# EAGLE design cyclops_r3 (EAGLE 6.5.0)
DESIGNER: JONATHAN P. NEWMAN; DOC_NUMBER: N/A; REVISION: 3.5C

## Sheet 1 of 5: I/O Interface
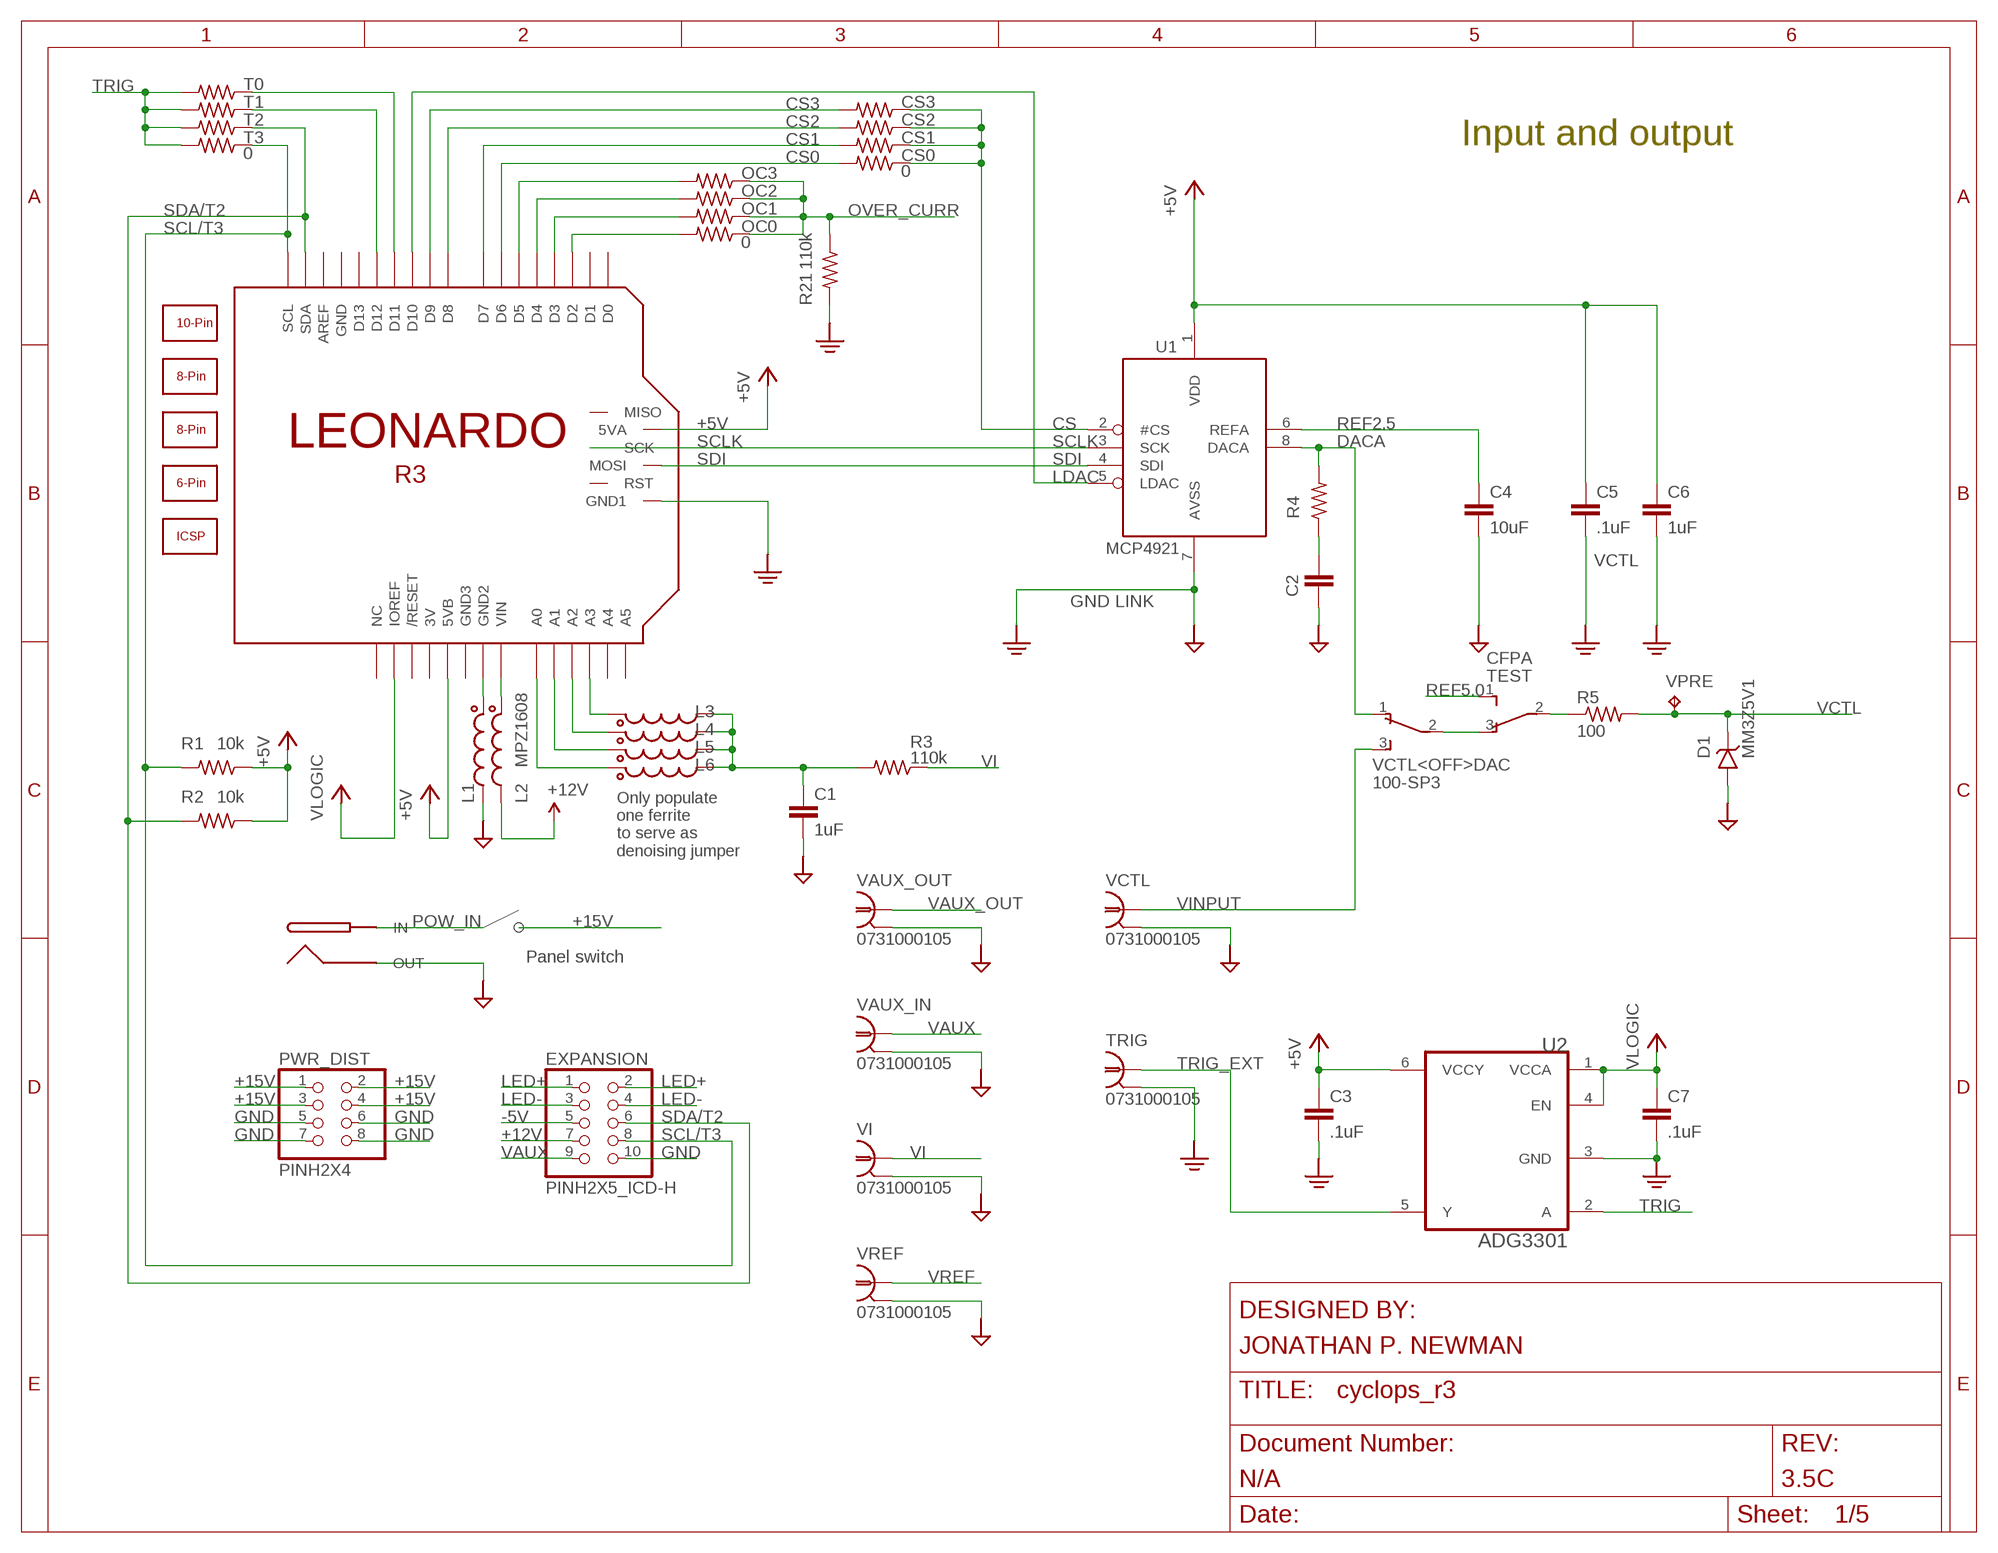
[diagram p0: schematic, sheet 1]

### Parts
C1  1uF  C_0805  [0805]
C2  C_0603  [0603]
C3  .1uF  C_0603  [0603]
C4  10uF  C_1206  [1206]
C5  .1uF  C_0603  [0603]
C6  1uF  C_0805  [0805]
C7  .1uF  C_0603  [0603]
CS0  0  R_0603  [0603]
CS1  0  R_0603  [0603]
CS2  0  R_0603  [0603]
CS3  0  R_0603  [0603]
D1  MM3Z5V1  Z-DIODE_SOD-323  [SOD-323]
EXPANSION  PINH2X5_ICD-H  [2X05-IDC]
L1  MPZ1608  L_0603  [0603]
L2  MPZ1608  L_0603  [0603]
L3  MPZ1608  L_0603  [0603]
L4  MPZ1608  L_0603  [0603]
L5  MPZ1608  L_0603  [0603]
L6  MPZ1608  L_0603  [0603]
LEONARDO  LEONARDO_R3_ICSP  [ARDUINOR3_PINS_NOHOLES]
OC0  0  R_0603  [0603]
OC1  0  R_0603  [0603]
OC2  0  R_0603  [0603]
OC3  0  R_0603  [0603]
POWER  PJ-063BH  BARREL-JACK_PJ-063BH  [PJ-063BH]
PWR_DIST  PINH2X4  [2X04-BIG]
R1  10k  R_0603  [0603]
R2  10k  R_0603  [0603]
R3  110k  R_0603  [0603]
R4  R_0603  [0603]
R5  100  R_0603  [0603]
R21  110k  R_0603  [0603]
T0  0  R_0603  [0603]
T1  0  R_0603  [0603]
T2  0  R_0603  [0603]
T3  0  R_0603  [0603]
TEST  CFPA  SPDT_CFPA  [CFPA]
TRIG  0731000105  BNC_0731000105  [0731000105]
U1  MCP4921  MCP4921SOIC  [SO08]
U2  ADG3301  ADG3301BKSZ-REEL  [SOT65P210X110-6N]
VAUX_IN  0731000105  BNC_0731000105  [0731000105]
VAUX_OUT  0731000105  BNC_0731000105  [0731000105]
VCTL  0731000105  BNC_0731000105  [0731000105]
VCTL<OFF>DAC  100-SP3  SPDT_2M-WITHOFF  [2M1-SP1-T2-B4-M6RE]
VI  0731000105  BNC_0731000105  [0731000105]
VPRE  TPTP16R  [TP16R]
VREF  0731000105  BNC_0731000105  [0731000105]

### Nets
+5V: C3.1 C5.1 C6.1 LEONARDO.5VA LEONARDO.5VB R1.1 R2.1 U1.1(VDD) U2.6(VCCY)
+12V [pwr]: EXPANSION.7 L2.2 ; also sheet 2,3,4,5
+15V [pwr]: PWR_DIST.1 PWR_DIST.2 PWR_DIST.3 PWR_DIST.4 ; also sheet 2
-5V: EXPANSION.5 ; also sheet 2
CS: CS0.1 CS1.1 CS2.1 CS3.1 U1.2(#CS)
CS0: CS0.2 LEONARDO.D6
CS1: CS1.2 LEONARDO.D7
CS2: CS2.2 LEONARDO.D8
CS3: CS3.2 LEONARDO.D9
DACA: R4.2 U1.8(DACA) VCTL<OFF>DAC.1
GND: C1.2 C2.2 C3.2 C4.2 C5.2 C6.2 C7.2 D1.A EXPANSION.10 L1.2 LEONARDO.GND1 POWER.2(OUT) PWR_DIST.5 PWR_DIST.6 PWR_DIST.7 PWR_DIST.8 R21.2 TRIG.2 TRIG.3 U1.7(AVSS) U2.3(GND) VAUX_IN.2 VAUX_IN.3 VAUX_OUT.2 VAUX_OUT.3 VCTL.2 VCTL.3 VI.2 VI.3 VREF.2 VREF.3 ; also sheet 2,3,4,5
KEEPOUT_GND: L1.1 LEONARDO.GND2
LDAC: LEONARDO.D10 U1.5(LDAC)
LED+: EXPANSION.1 EXPANSION.2 ; also sheet 5
LED-: EXPANSION.3 EXPANSION.4 ; also sheet 5
N$1: C2.1 R4.1
N$7: L6.1 LEONARDO.A0
N$11: C1.1 L3.2 L4.2 L5.2 L6.2 R3.2
N$14: R5.1 TEST.2
N$19: L5.1 LEONARDO.A1
N$21: L4.1 LEONARDO.A2
N$23: L3.1 LEONARDO.A3
N$34: TEST.3 VCTL<OFF>DAC.2
N$40: LEONARDO.D2 OC0.2
OC0: LEONARDO.D3 OC1.2
OC1: LEONARDO.D4 OC2.2
OC2: LEONARDO.D5 OC3.2
OVER_CURR: OC0.1 OC1.1 OC2.1 OC3.1 R21.1 ; also sheet 3,5
POW_IN [pwr]: POWER.1(IN)
REF2.5: C4.1 U1.6(REFA) ; also sheet 4
REF5.0: TEST.1 ; also sheet 4
SCL/T3: EXPANSION.8 LEONARDO.SCL R1.2 T3.1
SCLK: LEONARDO.SCK U1.3(SCK)
SDA/T2: EXPANSION.6 LEONARDO.SDA R2.2 T2.1
SDI: LEONARDO.MOSI U1.4(SDI)
T0: LEONARDO.D11 T0.1
T1: LEONARDO.D12 T1.1
TRIG: T0.2 T1.2 T2.2 T3.2 U2.2(A)
TRIG_EXT: TRIG.1 U2.5(Y)
VAUX: EXPANSION.9 VAUX_IN.1 ; also sheet 5
VAUX_OUT: VAUX_OUT.1 ; also sheet 5
VCTL: D1.C R5.2 VPRE.TP ; also sheet 5
VI: R3.1 VI.1 ; also sheet 3,5
VIN_ARDUINO: L2.1 LEONARDO.VIN ; also sheet 2
VINPUT: VCTL.1 VCTL<OFF>DAC.3
VLOGIC: C7.1 LEONARDO.IOREF U2.1(VCCA) U2.4(EN)
VREF: VREF.1 ; also sheet 5
Unconnected: LEONARDO.3V LEONARDO.A4 LEONARDO.A5 LEONARDO.AREF LEONARDO.D0 LEONARDO.D1 LEONARDO.D13 LEONARDO.GND LEONARDO.GND3 LEONARDO.MISO LEONARDO.RESERVED(NC) LEONARDO.RESET$1(/RESET) LEONARDO.RESET(RST)

### Notes on the sheet
- Input and output
- GND LINK
- Only populate 
  one ferrite
  to serve as 
  denoising jumper
- Panel switch

## Sheet 2 of 5: Power
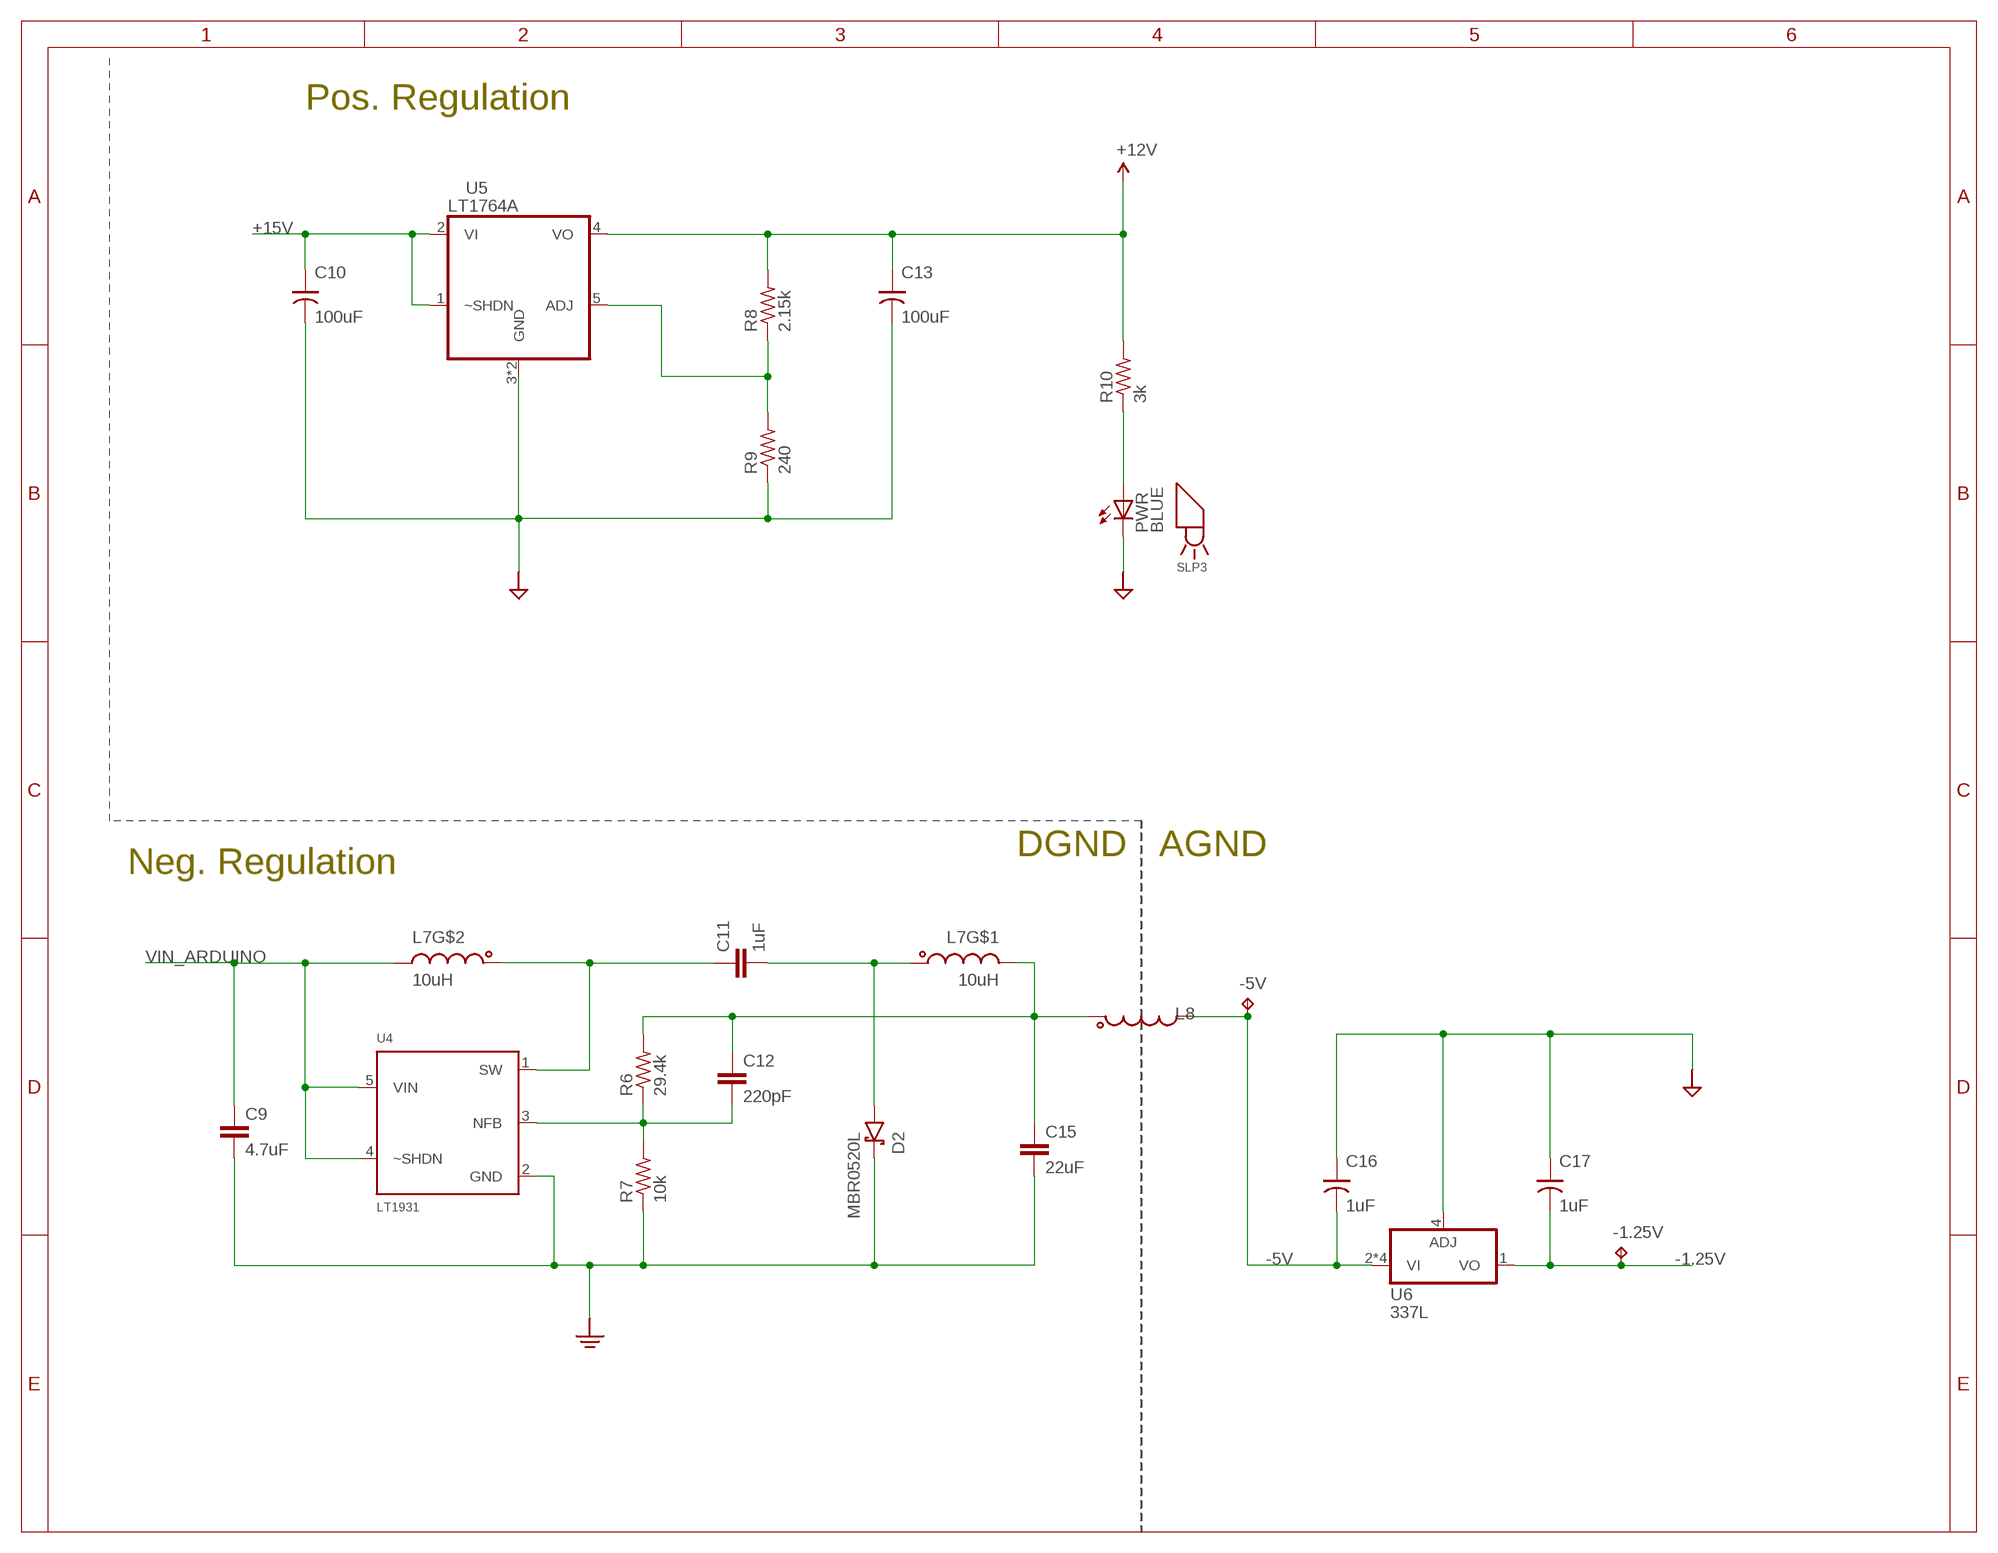
[diagram p1: schematic, sheet 2]

### Parts
-1.25V  TPTP16R  [TP16R]
-5V  TPTP16R  [TP16R]
C9  4.7uF  C_1206  [1206]
C10  100uF  C-POL_0807  [153CLV-0807]
C11  1uF  C_1206  [1206]
C12  220pF  C_0603  [0603]
C13  100uF  C-POL_0807  [153CLV-0807]
C15  22uF  C_1210  [1210]
C16  1uF  C-POL_1206  [1206-POL]
C17  1uF  C-POL_1206  [1206-POL]
D2  MBR0520L  S-DIODESOD-123  [SOD123]
L7  10uH  2L_CLS62  [CLS62]
L8  MPZ1608  L_0603  [0603]
PWR  BLUE  LED_0603  [LED-0603]
R6  29.4k  R_0603  [0603]
R7  10k  R_0603  [0603]
R8  2.15k  R_0603  [0603]
R9  240  R_0603  [0603]
R10  3k  R_0603  [0603]
U4  LT1931  LT1611  [SOT95P310X175-5N]
U5  LT1764A  LT1963_DDPAK  [5-DDPAK]
U6  337L  [SOIC127P600X175-8N]
X1  SLP3  LIGHT-PIPE_SL30-150-100-F  [SL3P-150-100-F]

### Nets
+12V [pwr]: C13.+ R8.2 R10.2 U5.4(VO) ; also sheet 1,3,4,5
+15V [pwr]: C10.+ U5.1(~SHDN) U5.2(VI) ; also sheet 1
-1.25V: -1.25V.TP C17.- U6.1(VO) ; also sheet 5
-5V: -5V.TP C16.- L8.2 U6.2(VI) U6.3(VI) U6.6(VI) U6.7(VI) ; also sheet 1
GND: C9.2 C10.- C13.- C15.2 C16.+ C17.+ D2.C PWR.C R7.1 R9.1 U4.2(GND) U5.3(GND) U5.TAB(GND) U6.4(ADJ) ; also sheet 1,3,4,5
N$3: PWR.A R10.1
N$12: R8.1 R9.2 U5.5(ADJ)
N$32: C11.1 L7.2 U4.1(SW)
N$33: C11.2 D2.A L7.1
N$35: C12.1 C15.1 L7.4 L8.1 R6.2
N$36: C12.2 R6.1 R7.2 U4.3(NFB)
VIN_ARDUINO: C9.1 L7.3 U4.4(~SHDN) U4.5(VIN) ; also sheet 1

### Notes on the sheet
- Pos. Regulation
- DGND | AGND
- Neg. Regulation

## Sheet 3 of 5: Over-current
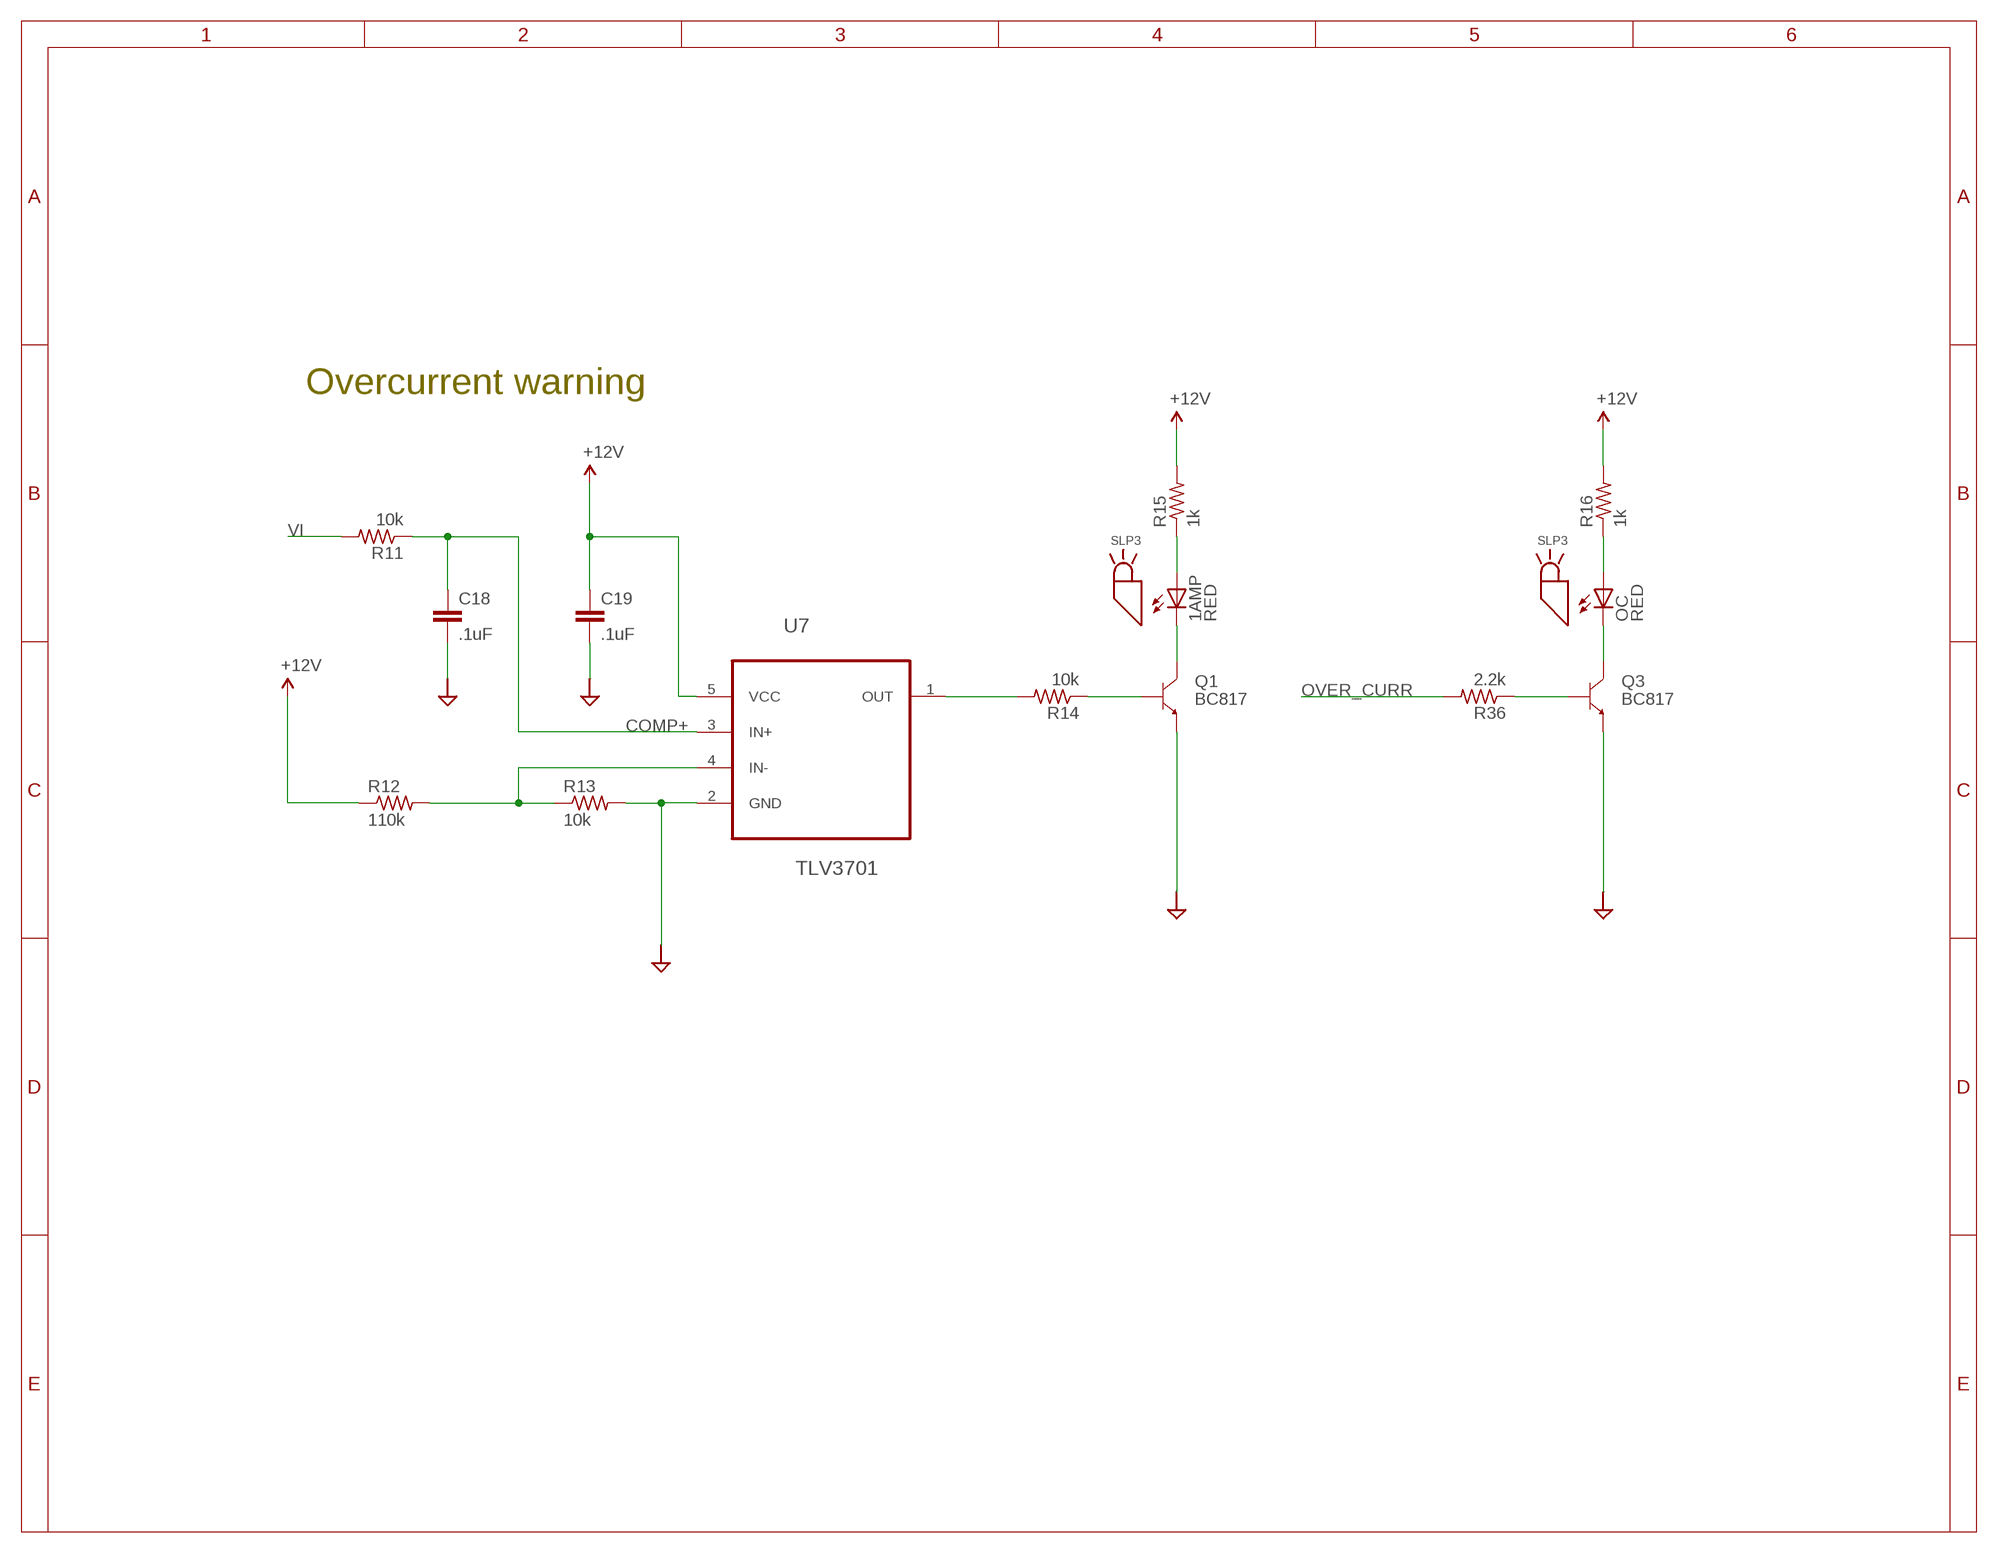
[diagram p2: schematic, sheet 3]

### Parts
1AMP  RED  LED_0603  [LED-0603]
C18  .1uF  C_0603  [0603]
C19  .1uF  C_0603  [0603]
OC  RED  LED_0603  [LED-0603]
Q1  BC817  BC817-16SMD  [SOT23-BEC]
Q3  BC817  BC817-16SMD  [SOT23-BEC]
R11  10k  R_0603  [0603]
R12  110k  R_0603  [0603]
R13  10k  R_0603  [0603]
R14  10k  R_0603  [0603]
R15  1k  R_0603  [0603]
R16  1k  R_0603  [0603]
R36  2.2k  R_0603  [0603]
U7  TLV3701  TLV3701CDBVT  [SOT95P280X145-5N]
X2  SLP3  LIGHT-PIPE_SL30-150-100-F  [SL3P-150-100-F]
X3  SLP3  LIGHT-PIPE_SL30-150-100-F  [SL3P-150-100-F]

### Nets
+12V [pwr]: C19.1 R12.1 R15.2 R16.2 U7.5(VCC) ; also sheet 1,2,4,5
COMP+: C18.1 R11.1 U7.3(IN+)
GND: C18.2 C19.2 Q1.E Q3.E R13.2 U7.2(GND) ; also sheet 1,2,4,5
N$2: 1AMP.A R15.1
N$5: R12.2 R13.1 U7.4(IN-)
N$9: 1AMP.C Q1.C
N$16: OC.A R16.1
N$27: R14.2 U7.1(OUT)
N$28: Q1.B R14.1
N$38: OC.C Q3.C
N$39: Q3.B R36.1
OVER_CURR: R36.2 ; also sheet 1,5
VI: R11.2 ; also sheet 1,5

### Notes on the sheet
- Overcurrent warning

## Sheet 4 of 5: VREF
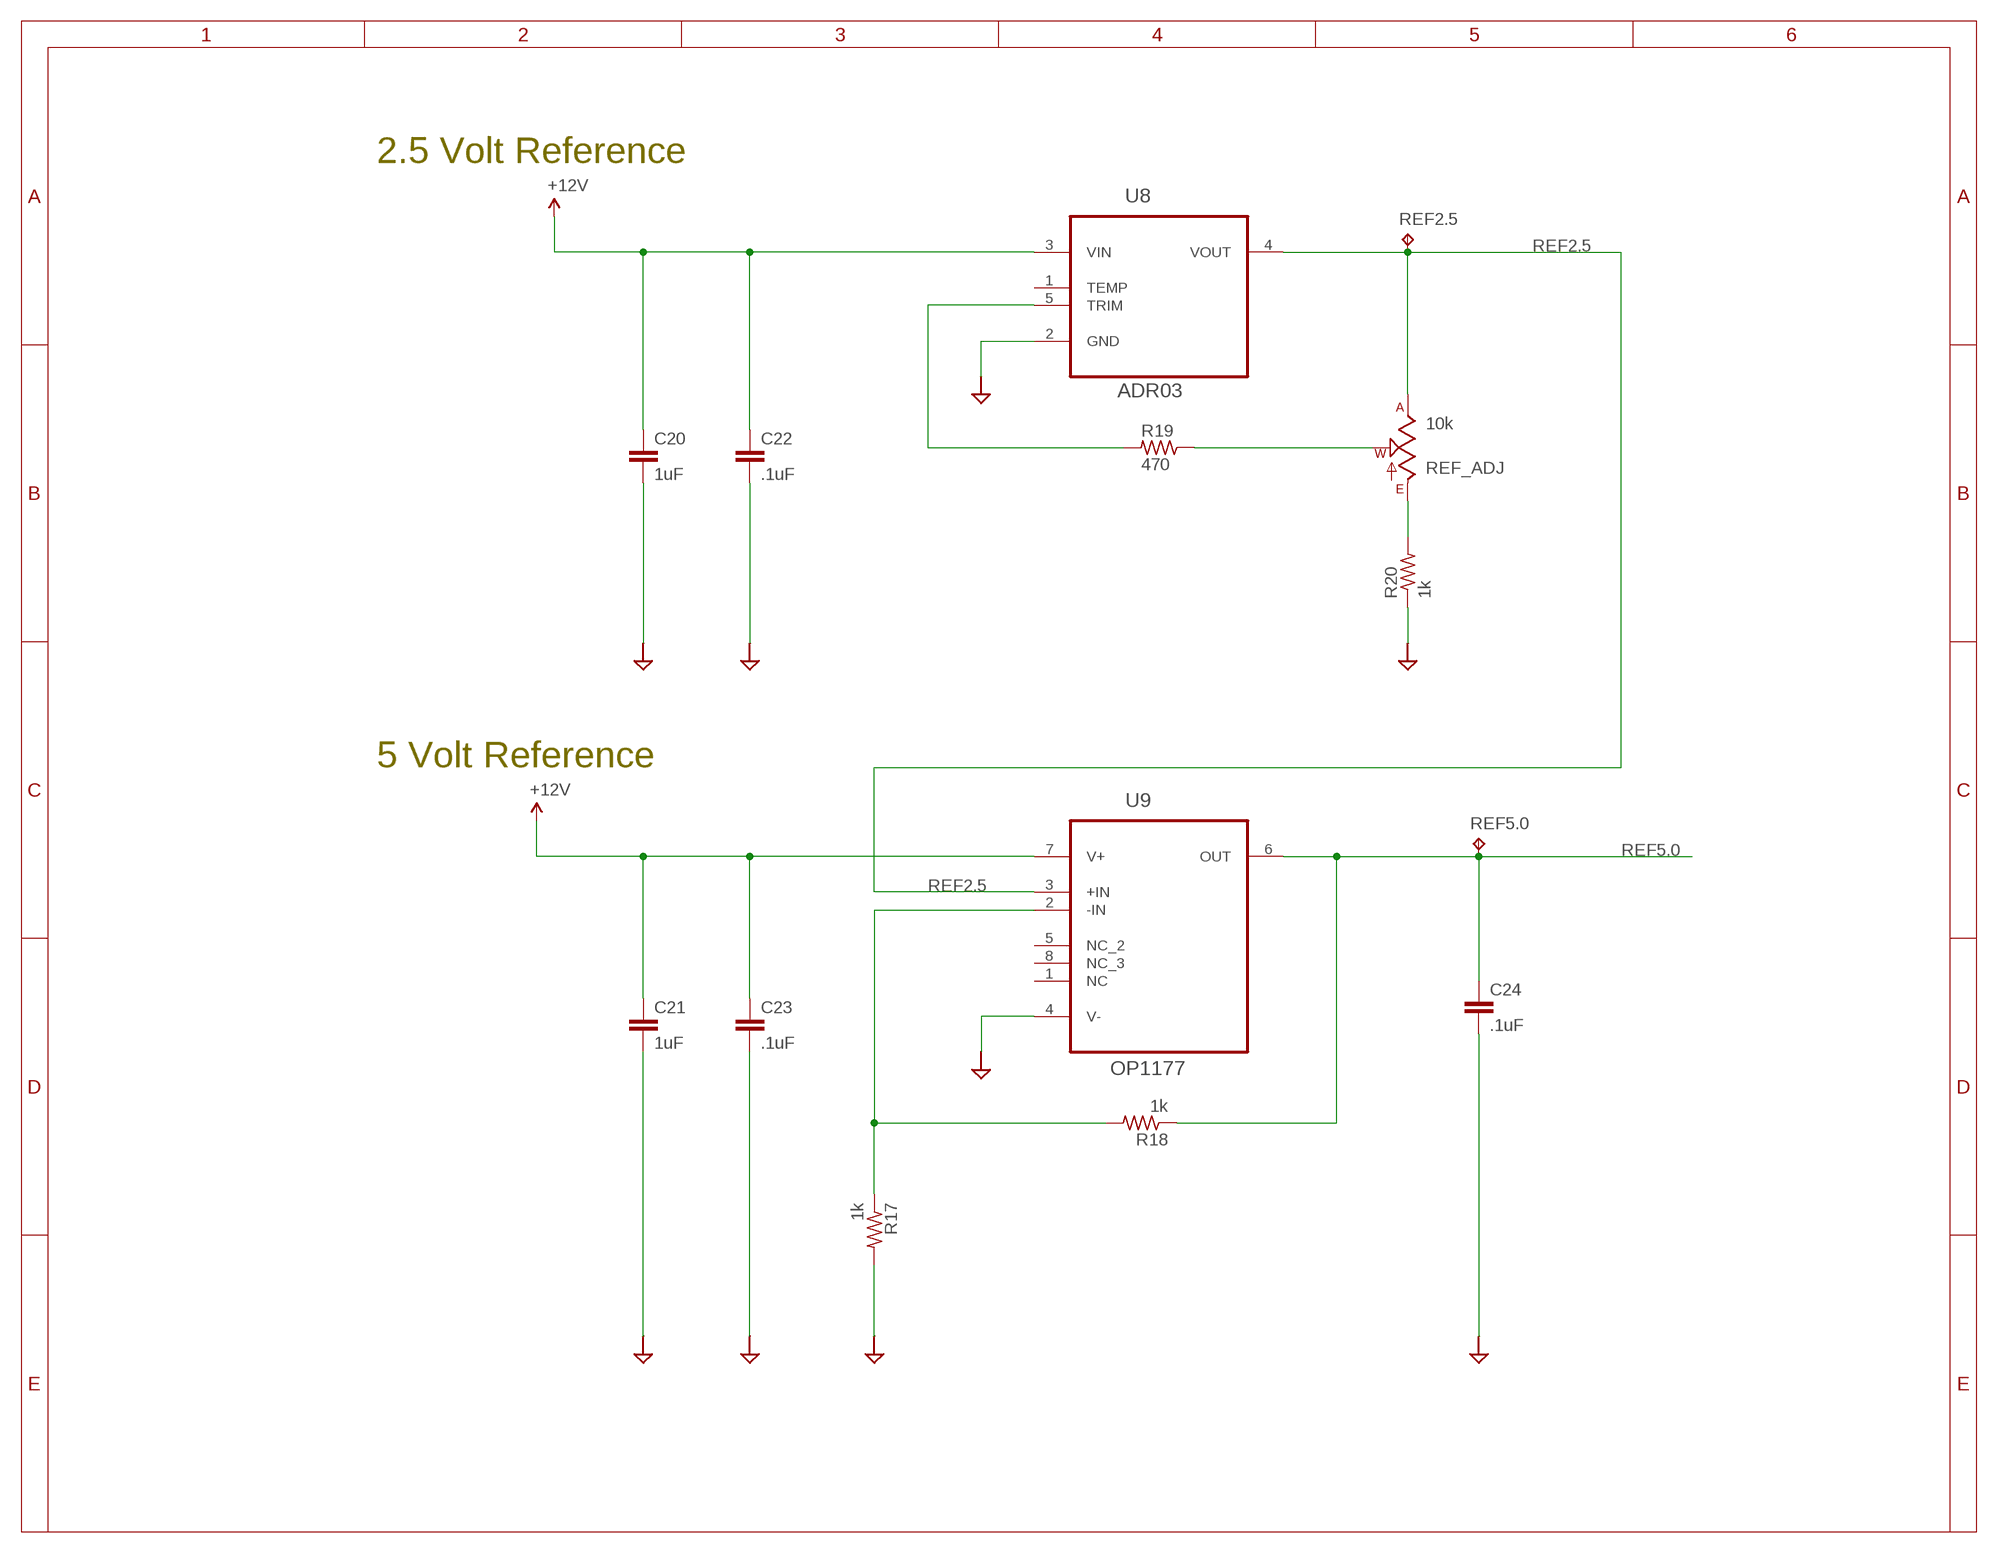
[diagram p3: schematic, sheet 4]

### Parts
C20  1uF  C_0805  [0805]
C21  1uF  C_0805  [0805]
C22  .1uF  C_0603  [0603]
C23  .1uF  C_0603  [0603]
C24  .1uF  C_0603  [0603]
R17  1k  R_0603  [0603]
R18  1k  R_0603  [0603]
R19  470  R_0603  [0603]
R20  1k  R_0603  [0603]
REF2.5  TPTP16R  [TP16R]
REF5.0  TPTP16R  [TP16R]
REF_ADJ  10k  TRIM_US-SM-42/43W  [SM-42/43W]
U8  ADR03  ADR03AKSZ-REEL7  [SOT65P210X110-5N]
U9  OP1177  OP1177ARMZ  [SOP65P490X110-8N]

### Nets
+12V [pwr]: C20.1 C21.1 C22.1 C23.1 U8.3(VIN) U9.7(V+) ; also sheet 1,2,3,5
GND: C20.2 C21.2 C22.2 C23.2 C24.2 R17.2 R20.1 U8.2(GND) U9.4(V-) ; also sheet 1,2,3,5
N$6: R20.2 REF_ADJ.3(E)
N$18: R17.1 R18.2 U9.2(-IN)
N$20: R19.2 U8.5(TRIM)
N$22: R19.1 REF_ADJ.2(W)
REF2.5: REF2.5.TP REF_ADJ.1(A) U8.4(VOUT) U9.3(+IN) ; also sheet 1
REF5.0: C24.1 R18.1 REF5.0.TP U9.6(OUT) ; also sheet 1
Unconnected: U8.1(TEMP) U9.1(NC) U9.5(NC_2) U9.8(NC_3)

### Notes on the sheet
- 2.5 Volt Reference
- 5 Volt Reference

## Sheet 5 of 5: Driver
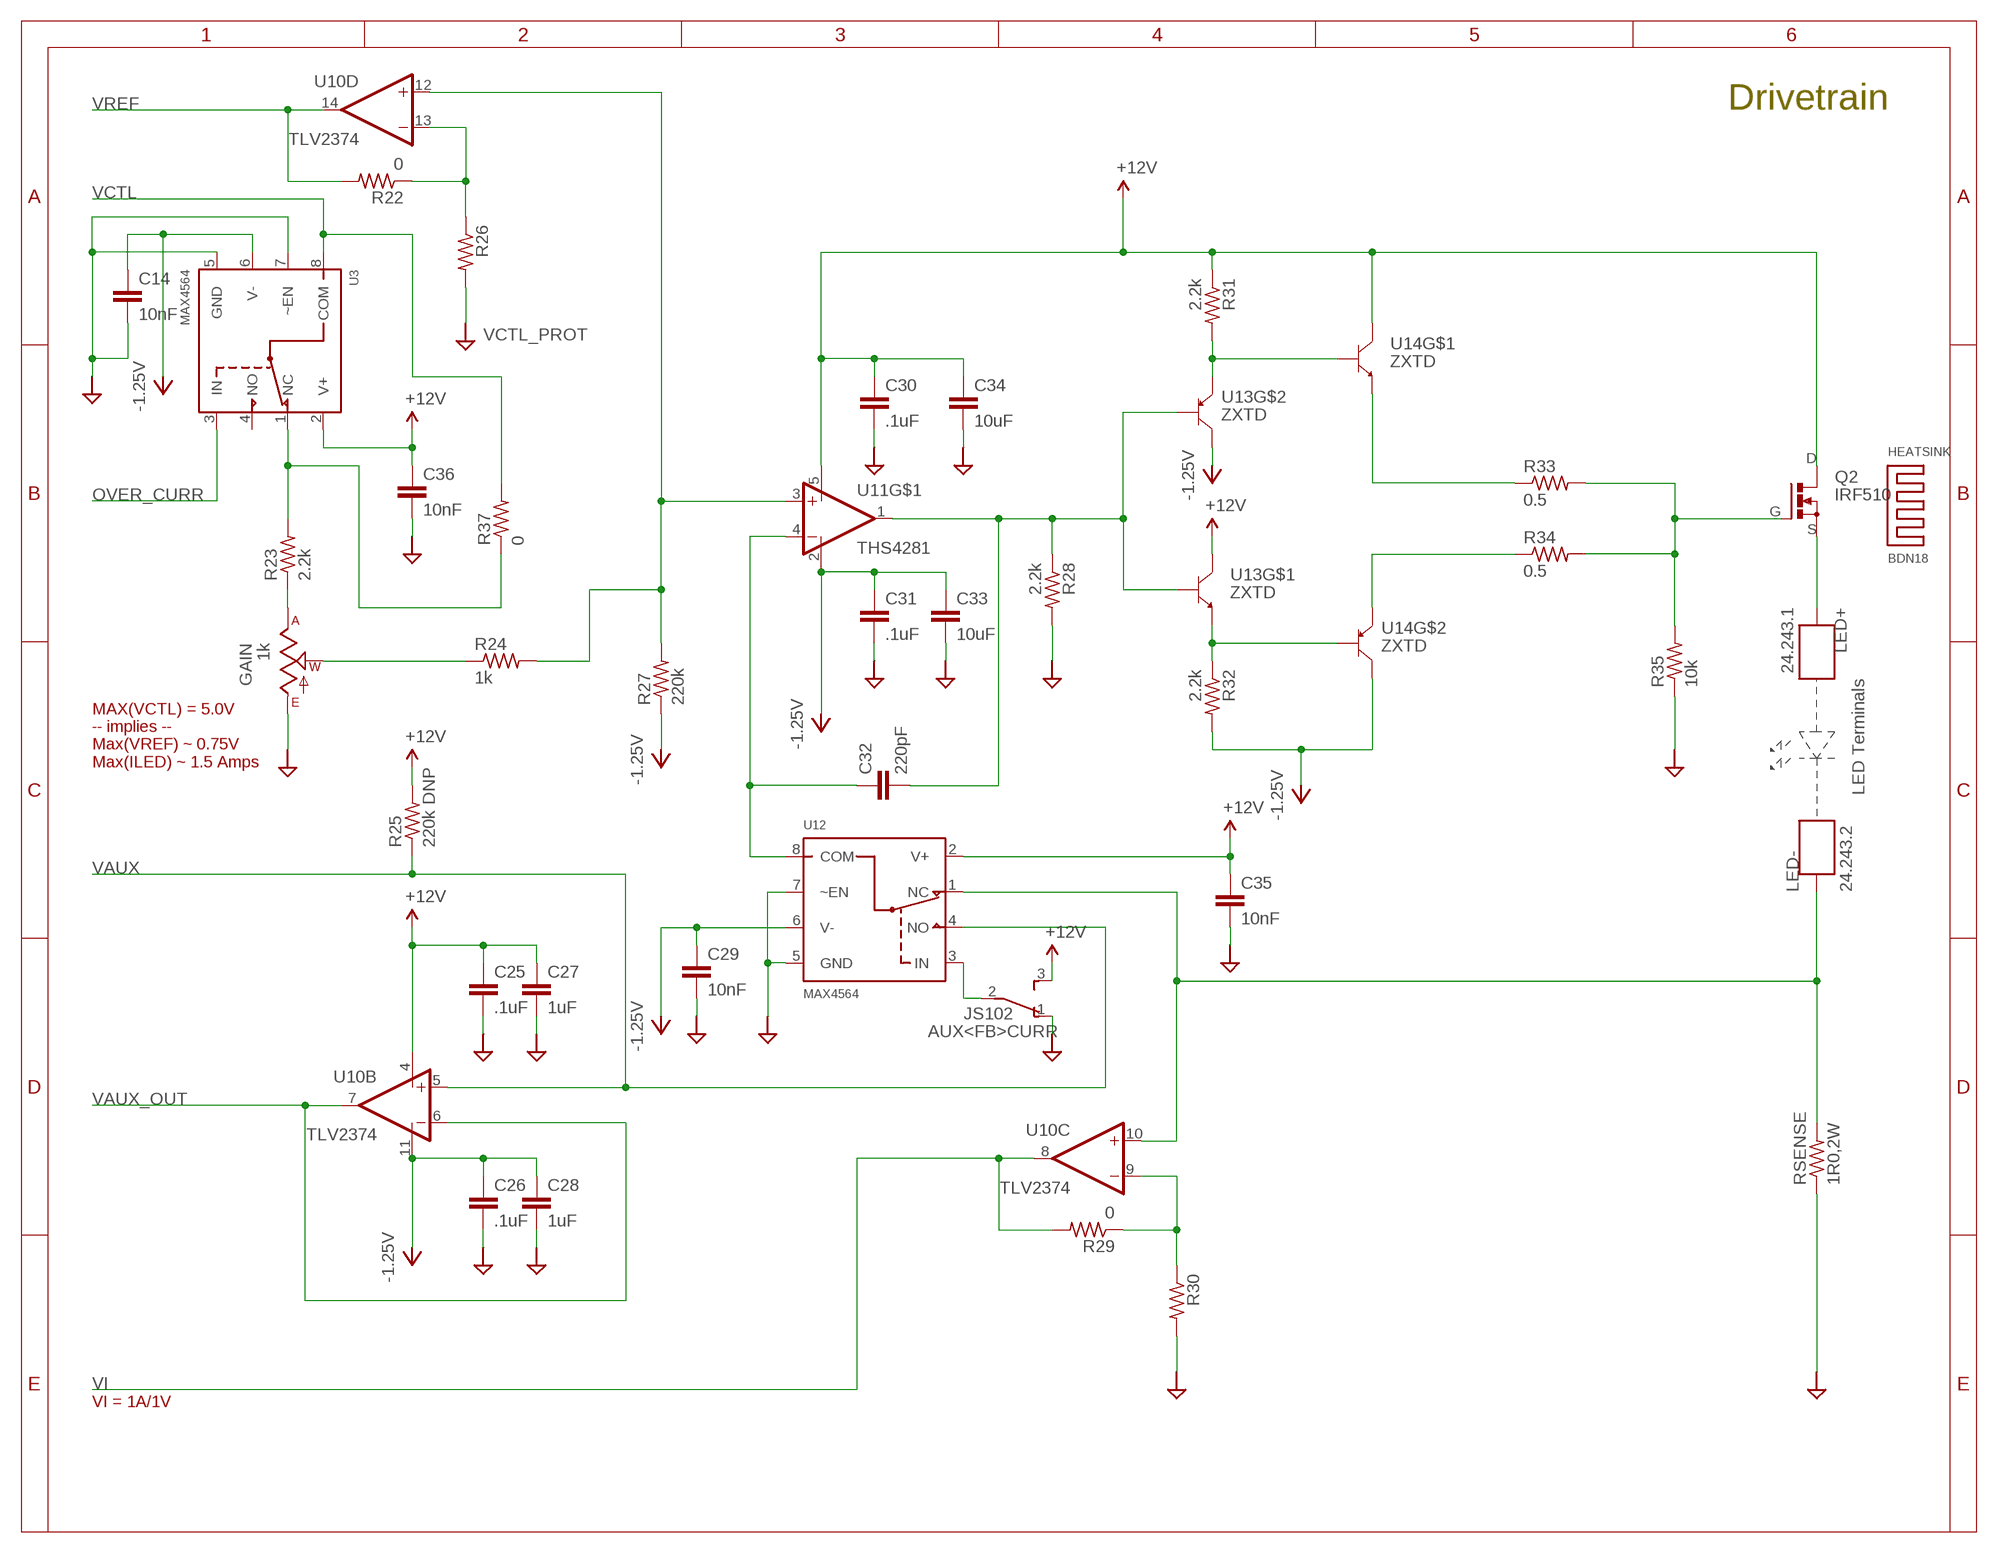
[diagram p4: schematic, sheet 5]

### Parts
AUX<FB>CURR  JS102  SPDT_JS  [JS102011SAQN]
C14  10nF  C_0603  [0603]
C25  .1uF  C_0603  [0603]
C26  .1uF  C_0603  [0603]
C27  1uF  C_0805  [0805]
C28  1uF  C_0805  [0805]
C29  10nF  C_0603  [0603]
C30  .1uF  C_0603  [0603]
C31  .1uF  C_0603  [0603]
C32  220pF  C_0603  [0603]
C33  10uF  C_1206  [1206]
C34  10uF  C_1206  [1206]
C35  10nF  C_0603  [0603]
C36  10nF  C_0603  [0603]
GAIN  1k  POT_US_3310  [3310C-001]
HEATSINK  BDN18  HEATSINK_BDN18  [BDN18]
LED+  24.243.1  BANANA_TO_BOARD_A2107  [A-2107]
LED-  24.243.2  BANANA_TO_BOARD_A2107  [A-2107]
Q2  IRF510  N-MOSFETTO-262  [TO-262_01]
R22  0  R_0603  [0603]
R23  2.2k  R_0603  [0603]
R24  1k  R_0603  [0603]
R25  220k  R_0603  [0603]
R26  R_0603  [0603]
R27  220k  R_0603  [0603]
R28  2.2k  R_0603  [0603]
R29  0  R_0603  [0603]
R30  R_0603  [0603]
R31  2.2k  R_0603  [0603]
R32  2.2k  R_0603  [0603]
R33  0.5  R_0603  [0603]
R34  0.5  R_0603  [0603]
R35  10k  R_0603  [0603]
R37  0  R_0603  [0603]
RSENSE  1R0,2W  R_2512  [2512]
U3  MAX4564  [SOT65P300X175-N]
U10  TLV2374  QUAD-OPAMP_14PIND  [SO14]
U11  THS4281  OPAMP_SOT-23  [SOT95P310X175-5N]
U12  MAX4564  [SOT65P300X175-N]
U13  ZXTD  ZXTD4591E6  [SOT23-6]
U14  ZXTD  ZXTD4591E6  [SOT23-6]

### Nets
+12V [pwr]: AUX<FB>CURR.3 C25.1 C27.1 C30.1 C34.1 C35.1 C36.1 Q2.D R25.2 R31.1 U3.2(V+) U10.4(P:V+) U11.5(V+) U12.2(V+) U13.1(C) U14.1(C) ; also sheet 1,2,3,4
-1.25V: C14.1 C26.1 C28.1 C29.1 C31.1 C33.1 R27.1 R32.2 U3.6(V-) U10.11(P:V-) U11.2(V-) U12.6(V-) U13.3(C) U14.3(C) ; also sheet 2
_VREF: R24.2 R27.2 U10.12(D:+IN) U11.3(+IN)
COM: C32.1 U11.4(-IN) U12.8(COM)
GND: AUX<FB>CURR.1 C14.2 C25.2 C26.2 C27.2 C28.2 C29.2 C30.2 C31.2 C33.2 C34.2 C35.2 C36.2 GAIN.1(E) R26.2 R28.2 R30.2 R35.1 RSENSE.1 U3.5(GND) U3.7(~EN) U12.5(GND) U12.7(~EN) ; also sheet 1,2,3,4
IN: AUX<FB>CURR.2 U12.3(IN)
LED+: LED+.1 LED+.2 Q2.S ; also sheet 1
LED-: LED-.1 LED-.2 RSENSE.2 U10.10(C:+IN) U12.1(NC) ; also sheet 1
N$4: R31.2 U13.4(E) U14.2(B)
N$8: R22.1 R26.1 U10.13(D:-IN)
N$10: R32.1 U13.6(E) U14.5(B)
N$13: C32.2 R28.1 U11.1(OUT) U13.2(B) U13.5(B)
N$15: R29.1 R30.1 U10.9(C:-IN)
N$24: R34.1 U14.4(E)
N$25: R33.1 U14.6(E)
N$26: Q2.G R33.2 R34.2 R35.2
N$37: GAIN.2(W) R24.1
OVER_CURR: U3.3(IN) ; also sheet 1,3
VAUX: R25.1 U10.5(B:+IN) U12.4(NO) ; also sheet 1
VAUX_OUT: U10.6(B:-IN) U10.7(B:OUT) ; also sheet 1
VCTL: R37.2 U3.8(COM) ; also sheet 1
VCTL_PROT: R23.2 R37.1 U3.1(NC)
VCTL_PROTECT: GAIN.3(A) R23.1
VI: R29.2 U10.8(C:OUT) ; also sheet 1,3
VREF: R22.2 U10.14(D:OUT) ; also sheet 1
Unconnected: U3.4(NO) U10.1(A:OUT) U10.2(A:-IN) U10.3(A:+IN)

### Notes on the sheet
- Drivetrain
- LED Terminals
- MAX(VCTL) = 5.0V
  -- implies --
  Max(VREF) ~ 0.75V
  Max(ILED) ~ 1.5 Amps
- DNP
- VI = 1A/1V

## Library data of the parts
1AMP OC PWR = cyclops:LED: Surface mount LED
-1.25V -5V REF2.5 REF5.0 VPRE = cyclops:TP: Test pad
AUX<FB>CURR TEST VCTL<OFF>DAC = cyclops:SPDT: SPDT Switch
C1 C6 C20 C21 C27 C28 = cyclops:C: Capacitor; MN: TDK Corp.; PARTNO: C2012X5R1Cxxxxxxx; VID: DK
C2-C5 C7 C9 C11 C12 C14 C15 C18 C19 C22-C26 C29-C36 = cyclops:C: Capacitor
C10 C13 C16 C17 = cyclops:C-POL: Polarized Capacitor
CS0 CS1-CS3 OC0 OC1-OC3 R1-R37 T0 T1-T3 = cyclops:R: Resistor; DK: PxxxxHTR-ND; MN: Panasonic; MPN: ERJ-3EKFxxxxV
D1 = cyclops:Z-DIODE: Zener Diode
D2 = cyclops:S-DIODE: Schottky Diode
EXPANSION = cyclops:PINH2X5
GAIN = cyclops:POT_US
HEATSINK = cyclops:HEATSINK
L1-L6 L8 = cyclops:L: Inductor
L7 = cyclops:2L
LED+ LED- = cyclops:BANANA_TO_BOARD: Female banana socket to board, right angle. Digikey part: J111-ND (or similar).
LEONARDO = cyclops:LEONARDO_R3_ICSP
POWER = cyclops:BARREL-JACK
PWR_DIST = cyclops:PINH2X4
Q1 Q3 = cyclops:BC817*: NPN Transistor
Q2 = cyclops:N-MOSFET: N-CHANNEL MOS FET SYMBOL
REF_ADJ = cyclops:TRIM_US-: POTENTIOMETER
RSENSE = cyclops:R: Resistor
TRIG VAUX_IN VAUX_OUT VCTL VI VREF = jonnew:BNC: BNC CONNECTOR M/A COM www.macom.com distributor Farnell 149-452
U1 = cyclops:MCP4921: 12-bit DAC with SPI interface Microchip Technoligies
U2 = cyclops:ADG3301BKSZ-REEL: Logic Level Translator; MPN: ADG3301BKSZ-REEL; OC_FARNELL: -; OC_NEWARK: 74R5845; PACKAGE: SC-70-6; SUPPLIER: Analog Devices
U3 U12 = cyclops:MAX4564
U4 = cyclops:LT1611
U5 = cyclops:LT1963: 1.5A, Low Noise Fast Transient Response LDO Regulators
U6 = cyclops:*337: Negative VOLTAGE REGULATOR
U7 = ti-extended:TLV3701CDBVT: FAMILY OF NANOPOWER PUSH-PULL OUTPUT COMPARATORS; MPN: TLV3701CDBVT; OC_FARNELL: 8455538; OC_NEWARK: 76C8790; PACKAGE: SOT-23-5; SUPPLIER: Texas Instruments
U8 = cyclops:ADR03AKSZ-REEL7: Ultracompact, Precision 10.0 V/5.0 V/2.5 V/3.0 V Voltage References; MPN: ADR03AKSZ-REEL7; OC_FARNELL: 1838919; OC_NEWARK: 59K2675; PACKAGE: SC70-5; SUPPLIER: Analog Devices
U9 = cyclops:OP1177ARMZ: Bias Current Operational Amplifiers; MPN: OP1177ARMZ; OC_FARNELL: 2074880; OC_NEWARK: 22P9695; PACKAGE: MSOP-8; SUPPLIER: Analog Devices
U10 = cyclops:QUAD-OPAMP_14PIN: OP AMP
U11 = cyclops:OPAMP
U13 U14 = cyclops:ZXTD4591E6: NPN/PNP Gate Driver
X1-X3 = cyclops:LIGHT-PIPE

## Board
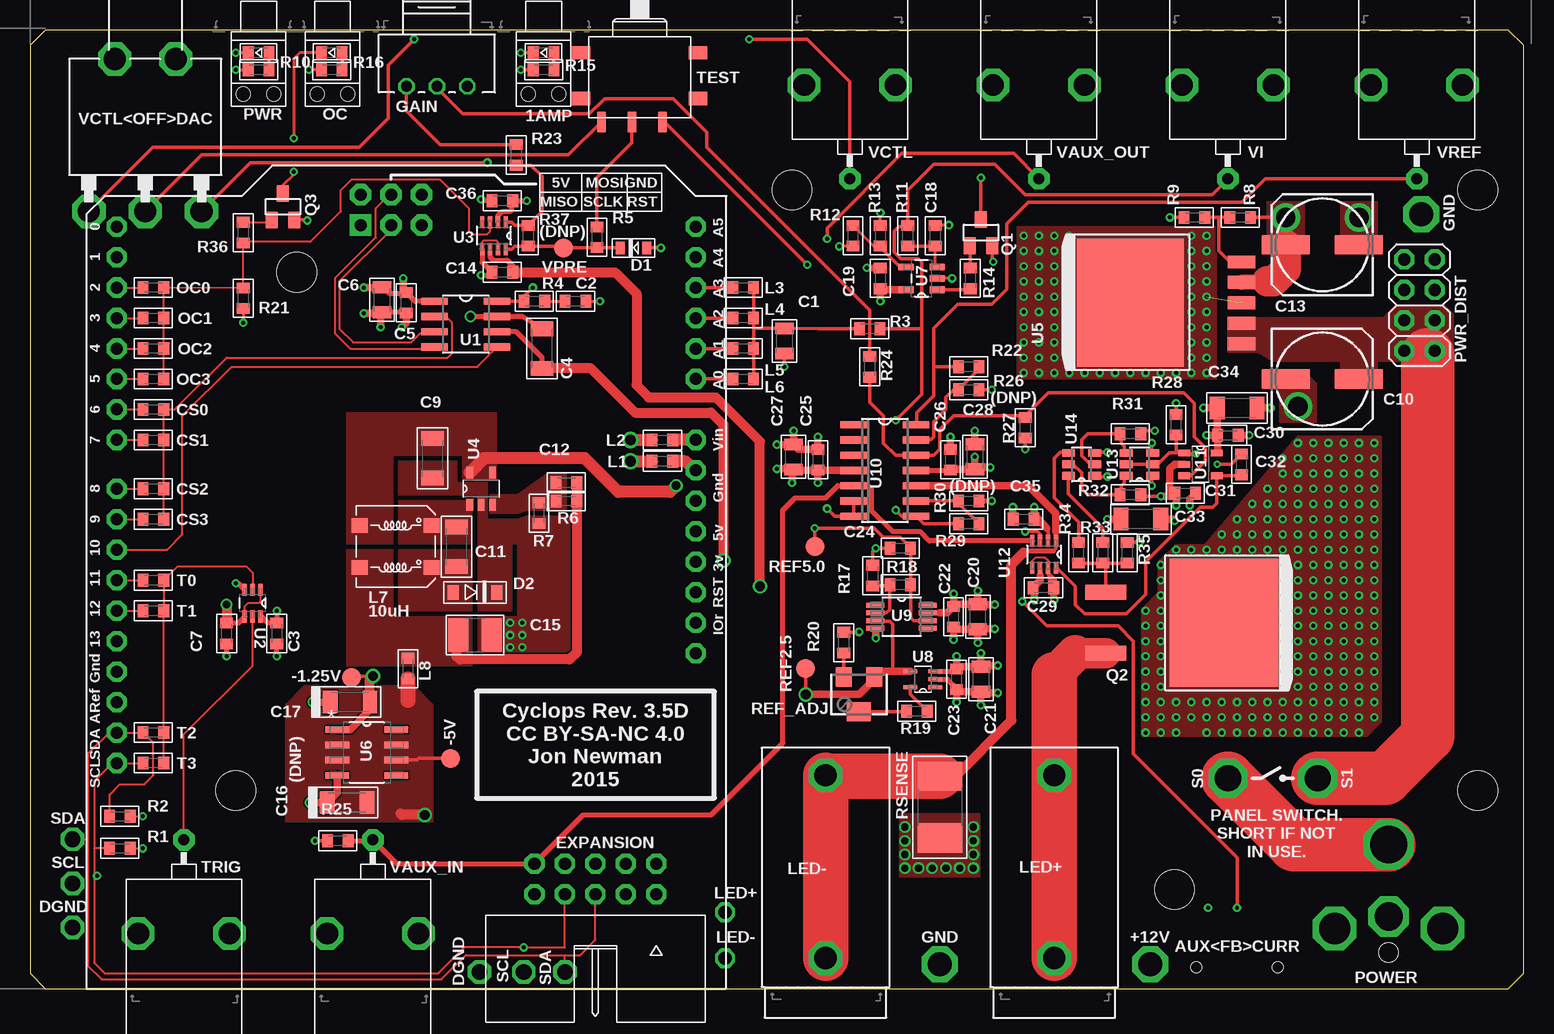
[diagram p5: board, top side]
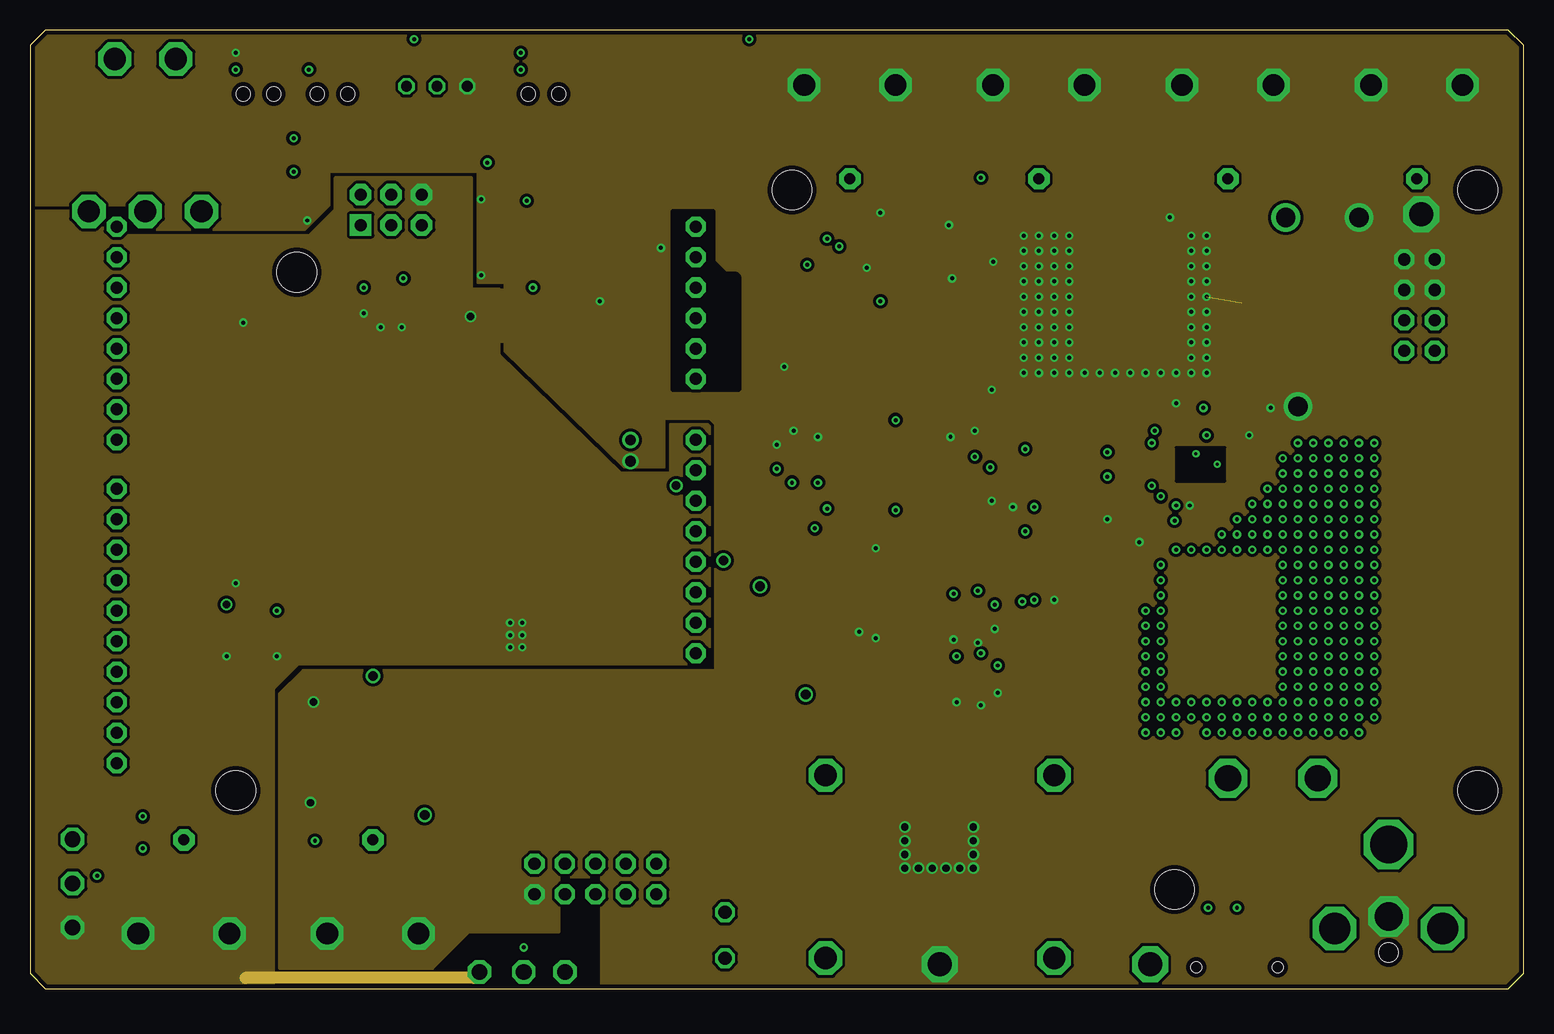
[diagram p6: board, inner layer Route2]
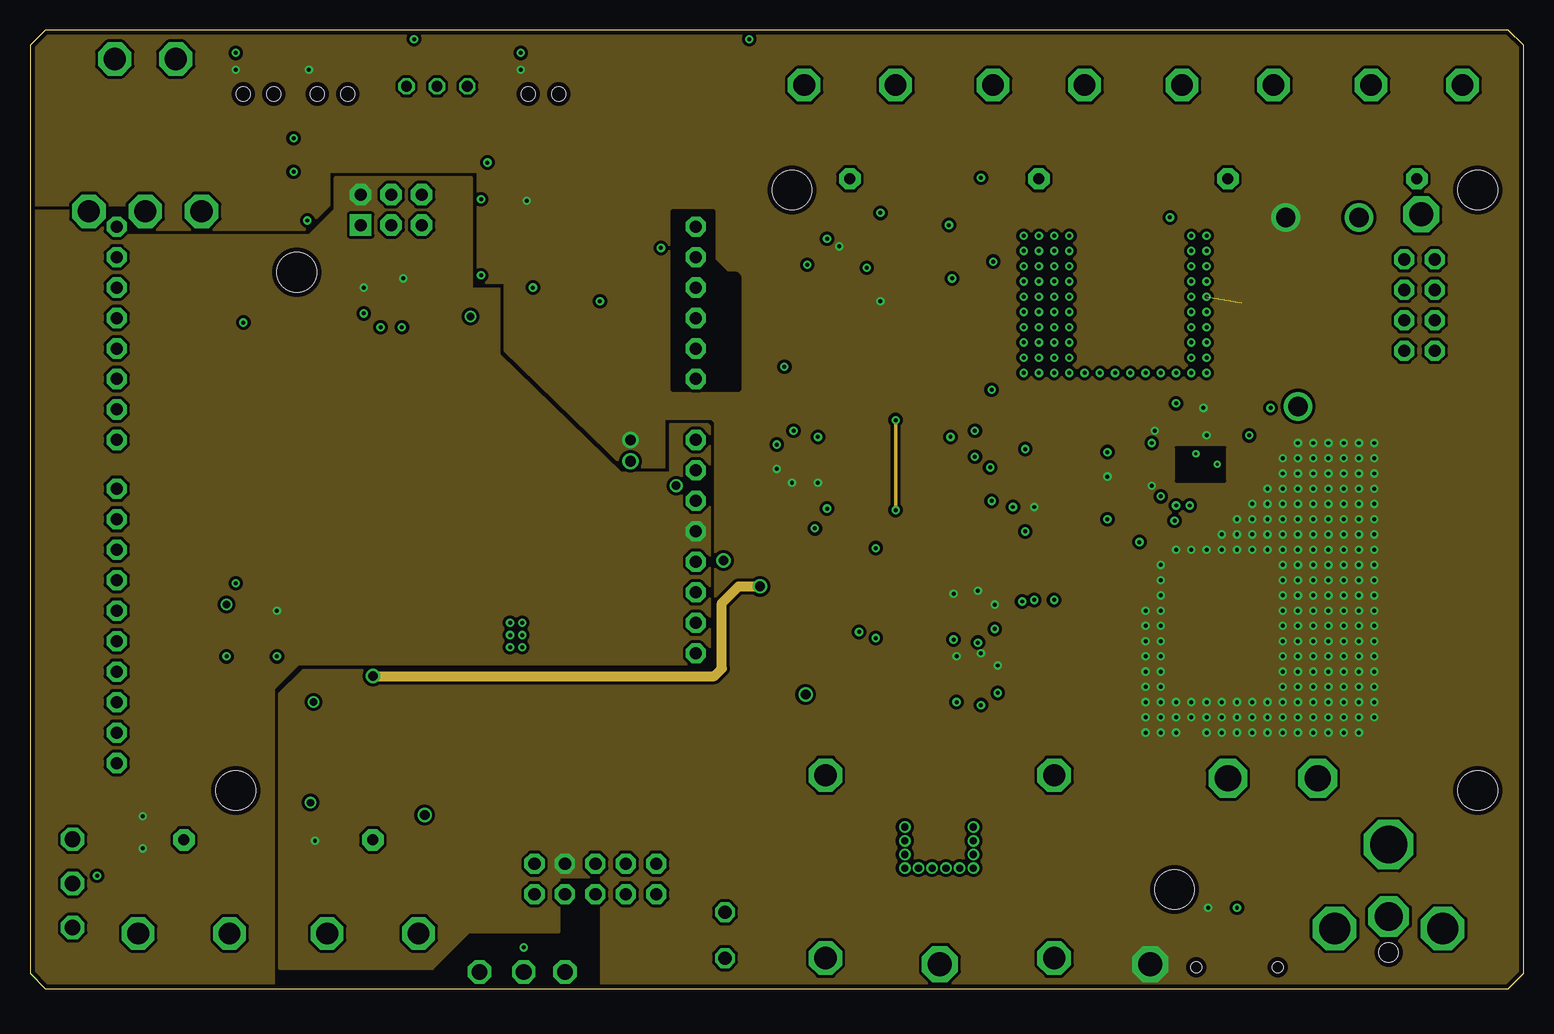
[diagram p7: board, inner layer Route15]
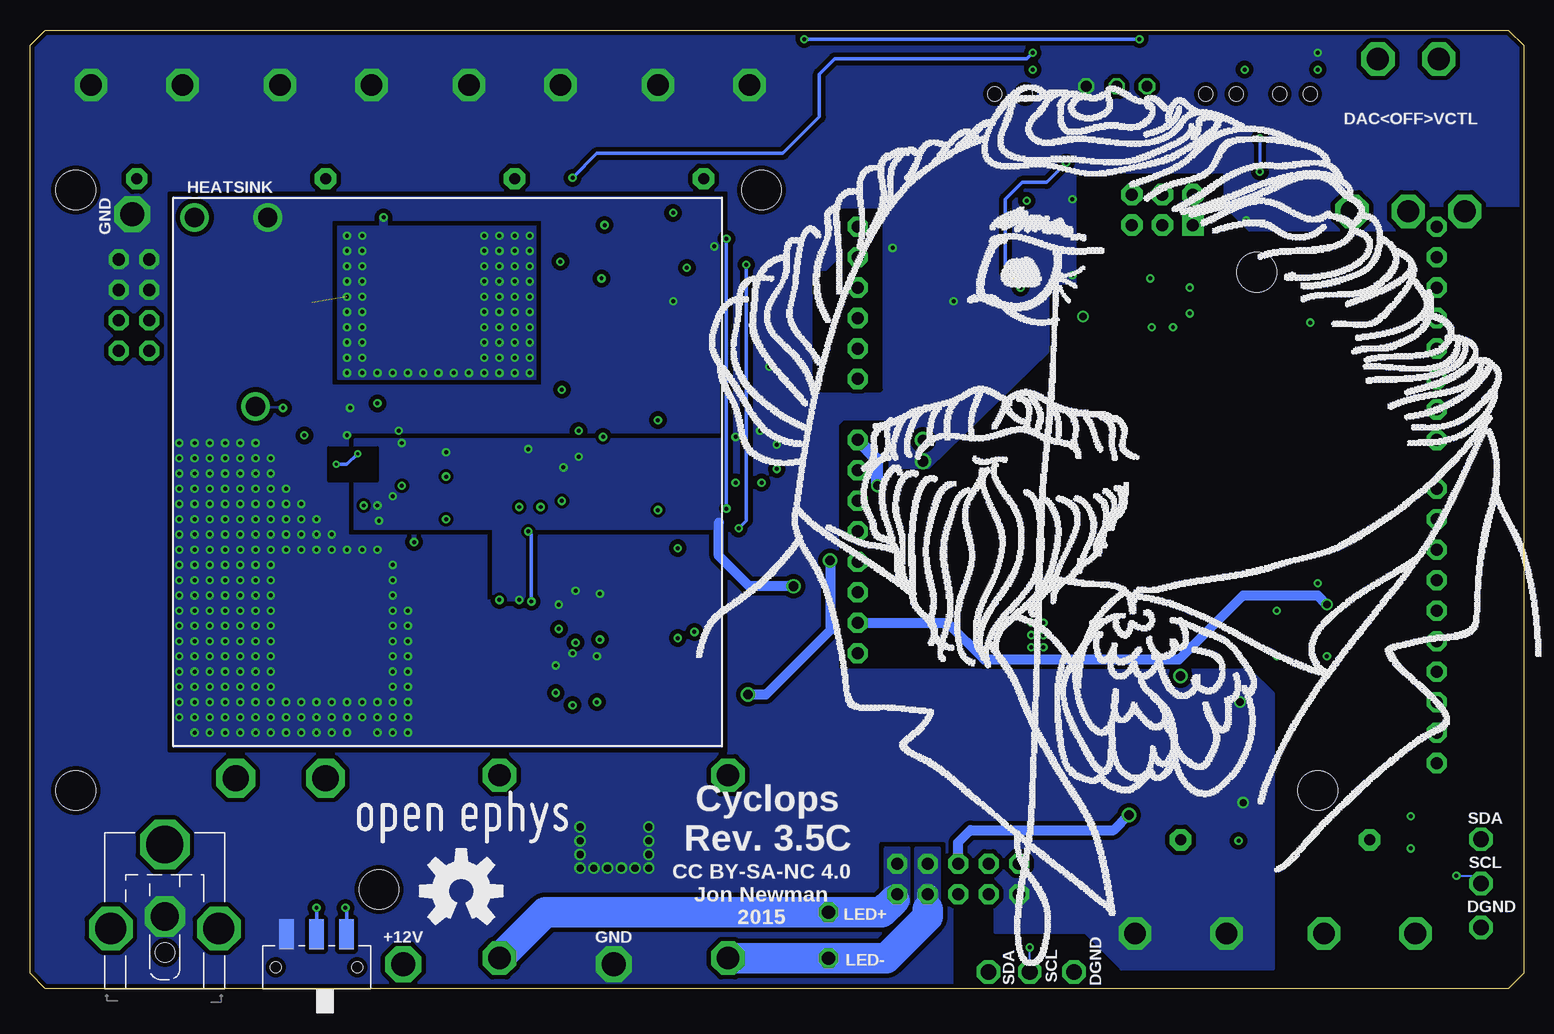
[diagram p8: board, bottom side, seen from below]

Size 124.46 x 79.88 mm. Coordinates in mm from the lower left corner, seen from the top.
Outline: 1.27,79.88 0,78.61 0,1.27 1.27,0 123.19,0 124.46,1.27 124.46,78.61 123.19,79.88 1.27,79.88
Copper layers (1+2*15+16): Top 0.0356mm / dielectric 1.5011mm / Route2 0.0356mm / dielectric 0.1499mm / Route15 0.0356mm / dielectric 0.2007mm / Bottom 0.0356mm
Design rules "ohs-park-4-layer": minimum track width 5mil, minimum drill 10mil, track to track 5mil, track to pad 5mil, pad to pad 5mil, via to via 5mil, smd to smd 5mil, copper to edge 15mil, drill to drill 5mil, minimum pad ring 7mil, minimum via ring 7mil, stop-mask expansion 4mil, vias tented up to drill 100mil, thermal gap 10mil
Holes 3.3 mm at 17.14,16.51 22.23,59.69 63.5,66.55 95.38,8.26 120.65,66.55 120.65,16.51
tKeepout: area 0,0 to 2.5,80; area 122.4,0 to 125,80
bKeepout: area 122.4,0 to 125,80

### Footprints (pad centres in the part's own frame; a part is rotated, then mirrored left to right if it is on the bottom)
LED-0603 = smd 1.067 x 0.889: A 0,0.406; C 0,2.134
TP16R = smd 1.6 x 1.6: TP 0,0
JS102011SAQN = smd 1.2 x 2.5: 1 -2.5,2.75; 2 0,2.75; 3 2.5,2.75 | hole 0.9: -3.4,0; 3.4,0
0805 = smd 0.965 x 1.524: 1 -1.041,0; 2 1.041,0
0603 = smd 0.889 x 1.067: 1 -0.864,0; 2 0.864,0
1206 = smd 1.219 x 1.88: 1 -1.651,0; 2 1.651,0
153CLV-0807 = smd 4 x 1.6: + 3.05,0; - -3.05,0
1210 = smd 1.651 x 2.794: 1 -1.397,0; 2 1.397,0
1206-POL = smd 1.219 x 1.88: + -1.651,0; - 1.651,0
SOD-323 = smd 0.762 x 1.016: A -1.118,0; C 1.118,0
SOD123 = smd 0.914 x 1.219: A -1.8,0; C 1.8,0
2X05-IDC = drill 1.016 pad 1.676 octagon: 1 -5.08,-2.54; 2 -5.08,0; 3 -2.54,-2.54; 4 -2.54,0; 5 0,-2.54; 6 0,0; 7 2.54,-2.54; 8 2.54,0; 9 5.08,-2.54; 10 5.08,0
3310C-001 = drill 0.9 octagon: 1 0,-2.54; 2 0,0; 3 0,2.54
CLS62 = smd 1.3 x 1.2: 1 -3,1.75; 2 -3,-1.75; 3 3,-1.75; 4 3,1.75
A-2107 = drill 1.854 octagon: 1 0,0; 2 15.24,0
ARDUINOR3_PINS_NOHOLES = drill 1 pad 1.676 octagon: 3V 35.56,2.54; 5VB 38.1,2.54; A0 50.8,2.54; A1 53.34,2.54; A2 55.88,2.54; A3 58.42,2.54; A4 60.96,2.54; A5 63.5,2.54; AREF 23.876,50.8; D0 63.5,50.8; D1 60.96,50.8; D2 58.42,50.8; D3 55.88,50.8; D4 53.34,50.8; D5 50.8,50.8; D6 48.26,50.8; D7 45.72,50.8; D8 41.656,50.8; D9 39.116,50.8; D10 36.576,50.8; D11 34.036,50.8; D12 31.496,50.8; D13 28.956,50.8; GND 26.416,50.8; GND2 43.18,2.54; GND3 40.64,2.54; IOREF 30.48,2.54; RESERVED 27.94,2.54; RESET 33.02,2.54; SCL 18.796,50.8; SDA 21.336,50.8; VIN 45.72,2.54 | drill 1 pad 1.778 octagon: 5VA 66.167,30.48; GND1 66.167,25.4; MOSI 66.167,27.94; RESET$1 63.627,25.4; SCK 63.627,27.94 | drill 1 pad 1.778 square: MISO 63.627,30.48
PJ-063BH = drill 3.1 octagon: 1 0,-12 | drill 2.35 octagon: 2 0,-6 | drill 2.6 octagon: M1 -4.5,-5.004; M2 4.5,-5.004 | hole 1.6: 0,-3
2X04-BIG = drill 1.016 pad 1.676 octagon: 1 -3.81,-1.27; 2 -3.81,1.27; 3 -1.27,-1.27; 4 -1.27,1.27; 5 1.27,-1.27; 6 1.27,1.27; 7 3.81,-1.27; 8 3.81,1.27
SOT23-BEC = smd 1 x 1.4: B -0.95,-1.1; C 0,1.1; E 0.95,-1.1
TO-262_01 = smd 10.668 x 9.017: D 0,4.508 | smd 1.27 x 3.429: G -2.54,-5.347; S 2.54,-5.347
SM-42/43W = smd 1.3 x 1.6: 1 -1.27,-1.45; 3 1.27,-1.45 | smd 2 x 1.6: 2 0,1.45
2512 = smd 2.45 x 3.7: 1 -2.575,0; 2 2.575,0
CFPA = smd 1.7 x 0.7: 1 3.85,1.9; 2 3.85,-0.64; 3 3.85,-3.18 | smd 1.1 x 1.55: NC1 -1.905,4.875; NC2 -1.905,-4.875; NC3 1.905,-4.875; NC4 1.905,4.875
0731000105 = drill 0.914 pad 1.778 octagon: 1 0,12.395 | drill 1.803 octagon: 2 -3.81,4.597; 3 3.81,4.597
SO08 = smd 0.6 x 2.2: 1 -1.905,-2.6; 2 -0.635,-2.6; 3 0.635,-2.6; 4 1.905,-2.6; 5 1.905,2.6; 6 0.635,2.6; 7 -0.635,2.6; 8 -1.905,2.6
SOT65P210X110-6N = smd 1.016 x 0.356: 1 -1.118,0.66; 2 -1.118,0; 3 -1.118,-0.66; 4 1.118,-0.66; 5 1.118,0; 6 1.118,0.66
SOT65P300X175-N = smd 1.016 x 0.356: 1 -1.118,0.66; 2 -1.118,0; 3 -1.118,-0.66; 4 -1.118,-1.31; 5 1.118,-1.31; 6 1.118,-0.66; 7 1.118,0; 8 1.118,0.66
SOT95P310X175-5N = smd 1 x 0.55: 1 -1.35,0.95; 2 -1.35,0; 3 -1.35,-0.95; 4 1.35,-0.95; 5 1.35,0.95
5-DDPAK = smd 1.067 x 2.286: 1 -3.404,-9.271; 2 -1.702,-9.271; 3 0,-9.271; 4 1.702,-9.271; 5 3.404,-9.271 | smd 10.668 x 8.89: TAB 0,0
SOIC127P600X175-8N = smd 1.981 x 0.533: 1 -2.464,1.905; 2 -2.464,0.635; 3 -2.464,-0.635; 4 -2.464,-1.905; 5 2.464,-1.905; 6 2.464,-0.635; 7 2.464,0.635; 8 2.464,1.905
SOT95P280X145-5N = smd 1.27 x 0.559: 1 -1.295,0.94; 2 -1.295,0; 3 -1.295,-0.94; 4 1.295,-0.94; 5 1.295,0.94
SOT65P210X110-5N = smd 1.168 x 0.356: 1 -1.041,0.66; 2 -1.041,0; 3 -1.041,-0.66; 4 1.041,-0.66; 5 1.041,0.66
SOP65P490X110-8N = smd 1.499 x 0.432: 1 -2.184,0.965; 2 -2.184,0.33; 3 -2.184,-0.33; 4 -2.184,-0.965; 5 2.184,-0.965; 6 2.184,-0.33; 7 2.184,0.33; 8 2.184,0.965
SO14 = smd 0.6 x 2.2: 1 -3.81,-2.6; 2 -2.54,-2.6; 3 -1.27,-2.6; 4 0,-2.6; 5 1.27,-2.6; 6 2.54,-2.6; 7 3.81,-2.6; 8 3.81,2.6; 9 2.54,2.6; 10 1.27,2.6; 11 0,2.6; 12 -1.27,2.6; 13 -2.54,2.6; 14 -3.81,2.6
SOT23-6 = smd 0.65 x 1.06: 1 -0.95,-1.1; 2 0,-1.1; 3 0.95,-1.1; 4 0.95,1.1; 5 0,1.1; 6 -0.95,1.1
2M1-SP1-T2-B4-M6RE = drill 1.854 octagon: 1 12.192,4.699; 2 12.192,0; 3 12.192,-4.699; M1 -0.508,-2.54; M2 -0.508,2.54
SL3P-150-100-F = hole 1.168: -1.27,0; 1.27,0

### Placement (x,y rotation side)
1AMP  44.07,77.98 90 top
-1.25V  26.8,25.91 0 top
-5V  35.05,19.18 0 top
AUX<FB>CURR  100.58,1.78 0 bottom
C1  62.87,53.98 270 top
C2  45.46,57.28 0 top
C3  20.57,29.59 270 top
C4  42.68,53.34 90 top
C5  31.36,57.15 270 top
C6  29.33,57.4 270 top
C7  16.38,29.59 270 top
C9  33.53,44.2 270 top
C10  107.7,50.8 0 top
C11  35.56,36.83 270 top
C12  44.7,42.16 180 top
C13  107.7,61.98 180 top
C14  39.37,59.69 180 top
C15  37.08,29.46 0 top
C16  26.42,15.49 0 top
C17  26.67,23.88 0 top
C18  75.44,62.74 90 top
C19  70.87,59.18 90 top
C20  78.99,30.99 270 top
C21  79.24,25.78 270 top
C22  76.95,30.99 270 top
C23  77.21,25.78 270 top
C24  72.52,36.7 180 top
C25  65.66,44.07 90 top
C26  76.71,44.07 90 top
C27  63.63,44.32 90 top
C28  78.74,44.32 90 top
C29  84.45,33.4 0 top
C30  99.82,46.1 0 top
C31  96.27,41.27 0 top
C32  100.97,43.69 90 top
C33  92.58,39.12 180 top
C34  100.58,48.39 0 top
C35  82.8,39.12 180 top
C36  39.37,65.66 180 top
CS0  10.29,48.26 180 top
CS1  10.29,45.72 180 top
CS2  10.29,41.66 180 top
CS3  10.29,39.12 180 top
D1  50.29,61.72 180 top
D2  37.08,33.02 0 top
EXPANSION  47.12,7.87 180 top
GAIN  33.91,75.18 90 top
HEATSINK  112.52,20.19 0 bottom
L1  52.7,43.94 180 top
L2  52.7,45.72 180 top
L3  59.44,58.42 0 top
L4  59.44,55.88 0 top
L5  59.44,53.34 0 top
L6  59.44,50.8 0 top
L7  30.48,36.83 180 top
L8  31.5,26.67 270 top
LED+  85.34,2.54 90 top
LED-  66.29,2.54 90 top
LEONARDO  58.03,0 90 top
OC  26.42,77.98 90 top
OC0  10.29,58.42 180 top
OC1  10.29,55.88 180 top
OC2  10.29,53.34 180 top
OC3  10.29,50.8 180 top
POWER  113.22,0 180 bottom
PWR  20.32,77.98 90 top
PWR_DIST  115.8,56.95 90 top
Q1  79.25,63 0 top
Q2  95,30.48 270 top
Q3  21.08,65.15 0 top
R1  7.49,11.68 180 top
R2  7.49,14.35 180 top
R3  69.98,54.99 180 top
R4  42.03,57.28 180 top
R5  47.24,62.61 270 top
R6  44.7,40.64 0 top
R7  42.42,39.62 90 top
R8  100.84,64.26 0 top
R9  97.03,64.26 0 top
R10  19.05,76.58 180 top
R11  73.15,62.74 90 top
R12  68.58,62.74 90 top
R13  70.87,62.74 90 top
R14  78.37,59.18 270 top
R15  42.8,76.58 180 top
R16  25.15,76.58 180 top
R17  70.23,34.42 90 top
R18  72.52,33.66 180 top
R19  73.91,23.11 0 top
R20  67.81,28.83 270 top
R21  17.78,57.53 270 top
R22  78.23,51.82 180 top
R23  40.51,69.47 270 top
R24  69.98,51.82 270 top
R25  25.65,12.32 180 top
R26  78.23,49.91 0 top
R27  82.93,46.74 90 top
R28  95.5,46.99 90 top
R29  78.22,38.73 180 top
R30  78.22,40.64 0 top
R31  91.69,46.23 180 top
R32  91.69,41.15 0 top
R33  89.41,36.32 270 top
R34  87.38,36.32 270 top
R35  91.44,36.32 270 top
R36  17.78,62.99 270 top
R37  41.53,62.74 270 top
REF2.5  64.64,26.67 90 top
REF5.0  65.4,36.83 90 top
REF_ADJ  69.08,24.51 180 top
RSENSE  75.82,15.12 90 top
T0  10.29,34.04 0 top
T1  10.29,31.5 0 top
T2  10.29,21.34 0 top
T3  10.29,18.8 0 top
TEST  50.81,76.07 270 top
TRIG  12.83,0 0 top
U1  36.32,55.37 270 top
U2  18.54,32.13 270 top
U3  38.99,62.74 270 top
U4  37.59,41.66 90 top
U5  91.69,57.15 90 top
U6  28.07,19.68 0 top
U7  74.3,59.18 180 top
U8  74.42,25.78 180 top
U9  72.64,30.99 0 top
U10  71.24,43.18 270 top
U11  97.54,43.69 0 top
U12  84.84,36.2 270 top
U13  92.46,43.69 90 top
U14  87.63,43.69 90 top
U$30  OPEN_EPHYS_LOGO  [OPEN_EPHYS_LOGO]  97.83,11.64 0 bottom
U$56  [CYCLOPS_LOGO]  38.01,38.35 0 bottom
U$60  [OSHW-LOGO-L]  88.52,8.13 0 bottom
VAUX_IN  28.57,0 0 top
VAUX_OUT  84.07,79.88 180 top
VCTL  68.33,79.88 180 top
VCTL<OFF>DAC  9.6,76.96 270 top
VI  99.82,79.88 180 top
VPRE  44.45,61.72 0 top
VREF  115.57,79.88 180 top
X1  19.05,74.55 0 top
X2  42.8,74.55 0 top
X3  25.21,74.55 0 top

### Tracks (layer width: path | path; a pad name or v marks a point on that pad's centre or on a via)
+5V  (via drill 0.33)
  Top 0.178: R2.1 v9.4,14.35 | R1.1 v9.4,11.68
  Top 0.406: U1.1 32.1,57.28 C5.1 | 31.24,57.91 29.97,57.91 29.44,58.45 C6.1 | v20.57,31.5 C3.1 20.55,30.48 19.81,30.48 19.28,31.01 U2.6
  Top 0.61: C6.1 29.3,58.42 v27.81,58.42 | v31.11,59.18 31.11,58.26 C5.1 31.39,58.04
  pour Route15 (isolate 0.254, no thermals): 36.83,67.56 25.4,67.56 25.4,64.89 23.24,62.74 8.13,62.74 8.13,64.77 0,64.77 0,0 20.32,0 20.32,24.97 22.4,27.05 56.64,27.05 56.64,46.86 56.52,46.99 53.34,46.99 53.34,42.93 49.28,42.93 39.12,52.83 39.12,58.29 36.83,58.29
+12V  (via drill 0.33, 0.9, 1.6 pad 0.33, 2)
  Top 0.254: v17.14,76.58 R10.2 | R12.1 68.56,61.85 v67.44,61.85 | 79.25,26.8 79.38,26.67 | R16.2 v23.24,76.58
  Top 0.305: 79.25,26.8 C21.1 | 76.96,31.88 76.96,31.86 C22.1 | v40.89,76.58 41.41,76.57 R15.2 | R25.2 v23.75,12.32 | U12.2 84.84,38.23 84.71,38.35 | R31.1 92.81,46.48 v93.73,46.48 | v104.65,64.26 R8.2 | v89.79,42.67 88.8,42.67 U14.1 | U13.1 93.47,42.65 v93.47,41.91
  Top 0.406: U8.3 77.01,26.44 C23.1 | 75.82,31.32 U9.7 | U3.2 38.99,64.39 39.37,64.77 40.01,64.77 40.13,64.9 40.13,65.56 C36.1 v41.4,65.66
  Top 0.61: v70.87,57.28 C19.1 70.94,58.24 U7.5 | C21.1 77.39,26.82 C23.1 77.11,26.54 | C20.1 77.13,32.03 C22.1 76.42,31.32 75.82,31.32 | v79.25,27.94 79.25,26.8 | v80.64,26.92 79.38,26.92 | v77.22,27.69 77.22,26.67 | v78.99,33.15 78.99,32 v80.39,32 | v62.23,43.31 63.5,43.31 | 63.5,43.27 v63.5,42.16 | v76.96,32.89 76.96,31.88 | C25.1 v65.66,42.16 | U10.4 67.18,43.18 C25.1 | C27.1 63.7,43.2 C25.1 | 84.71,38.35 84.07,39.12 C35.1 83.69,39.14 v83.69,40.13 | U11.5 98.96,44.71 C30.1 | C30.1 98.93,46.13 C34.1 | v98.04,46.1 C30.1 | v97.79,48.39 98.81,48.39
  Top 1.016: v50.04,45.72 L2.2
  Top 1.27: 103.12,58.93 103.05,58.85 U5.4
  Top 2.54: C13.+ 104.65,59.94 103.63,58.93 103.12,58.93
  Bottom 0.305: v98.17,6.73 98.08,6.73 AUX<FB>CURR.3
  other vias: 110.74,31.5 112.01,37.85 110.74,37.85 109.47,37.85 108.2,37.85 106.93,37.85 105.66,37.85 104.39,37.85 103.12,37.85 101.85,37.85 100.58,37.85 99.31,37.85 101.85,40.39 112.01,36.58 110.74,36.58 109.47,36.58 108.2,36.58 106.93,36.58 105.66,36.58 104.39,36.58 103.12,36.58 101.85,36.58 100.58,36.58 99.31,36.58 98.04,36.58 104.39,35.31 105.66,35.31 106.93,35.31 108.2,35.31 109.47,35.31 110.74,35.31 112.01,35.31 112.01,34.04 110.74,34.04 109.47,34.04 108.2,34.04 106.93,34.04 105.66,34.04 104.39,34.04 112.01,39.12 110.74,39.12 109.47,39.12 108.2,39.12 106.93,39.12 105.66,39.12 104.39,39.12 103.12,39.12 101.85,39.12 100.58,39.12 106.93,42.93 105.66,42.93 104.39,32.77 105.66,32.77 106.93,32.77 108.2,32.77 109.47,32.77 110.74,32.77 112.01,32.77 112.01,31.5 109.47,31.5 108.2,31.5 106.93,31.5 105.66,31.5 104.39,31.5 104.39,30.23 105.66,30.23 106.93,30.23 108.2,30.23 109.47,30.23 110.74,30.23 112.01,30.23 112.01,28.96 110.74,28.96 109.47,28.96 108.2,28.96 106.93,28.96 105.66,28.96 104.39,28.96 104.39,27.69 105.66,27.69 106.93,27.69 108.2,27.69 109.47,27.69 110.74,27.69 112.01,27.69 112.01,26.42 110.74,26.42 109.47,26.42 108.2,26.42 106.93,26.42 105.66,26.42 104.39,26.42 104.39,25.15 105.66,25.15 106.93,25.15 108.2,25.15 109.47,25.15 110.74,25.15 112.01,25.15 112.01,23.88 110.74,23.88 109.47,23.88 108.2,23.88 106.93,23.88 105.66,23.88 104.39,23.88 103.12,23.88 101.85,23.88 100.58,23.88 99.31,23.88 98.04,23.88 98.04,22.61 99.31,22.61 100.58,22.61 101.85,22.61 103.12,22.61 104.39,22.61 105.66,22.61 106.93,22.61 108.2,22.61 109.47,22.61 110.74,22.61 112.01,22.61 94.23,31.5 94.23,34.04 94.23,35.31 95.5,36.58 96.77,36.58 94.23,32.77 95.5,23.88 95.5,22.61 96.77,22.61 96.77,23.88 93.34,2.03 94.23,22.61 94.23,30.23 94.23,28.96 94.23,27.69 94.23,26.42 94.23,25.15 94.23,23.88 103.12,40.39 104.39,40.39 105.66,40.39 106.93,40.39 108.2,40.39 109.47,40.39 110.74,40.39 112.01,40.39 112.01,41.66 110.74,41.66 109.47,41.66 108.2,41.66 106.93,41.66 105.66,41.66 104.39,41.66 103.12,41.66 104.39,42.93 92.96,22.61 92.96,23.88 92.96,25.15 92.96,26.42 92.96,27.69 92.96,28.96 92.96,30.23 92.96,31.5 108.2,42.93 109.47,42.93 110.74,42.93 112.01,42.93 112.01,44.2 110.74,44.2 109.47,44.2 108.2,44.2 106.93,44.2 105.66,44.2 105.66,45.47 106.93,45.47 108.2,45.47 109.47,45.47 110.74,45.47 112.01,45.47 104.39,44.2 98.04,21.34 99.31,21.34 100.58,21.34 101.85,21.34 103.12,21.34 104.39,21.34 105.66,21.34 106.93,21.34 108.2,21.34 109.47,21.34 110.74,21.34 95.5,21.34 94.23,21.34 92.96,21.34
  pour Bottom (isolate 0.381, rank 2, no thermals): 66.8,65.91 112.52,65.91 112.52,20.19 66.8,20.19
  pour Top: 112.52,45.97 112.52,22.22 111.39,21.08 92.71,21.08 92.71,31.62 94.11,33.02 94.11,35.56 95.5,36.96 97.92,36.96 105.66,45.97
  pour Route15 (isolate 0.254, rank 3, no thermals): 0,65.28 0,78.66 1.23,79.88 27.05,80.01 124.97,80.14 124.97,0 47.62,0 47.62,9.27 44.07,9.27 44.07,4.7 36.58,4.7 33.53,1.65 20.83,1.65 20.83,24.61 22.76,26.54 57.15,26.54 57.15,46.99 56.64,47.5 52.83,47.5 52.83,43.43 49.53,43.43 39.62,53.09 39.62,58.8 37.34,58.8 37.34,68.07 24.89,68.07 24.89,65.23 22.91,63.25 8.64,63.25 8.64,65.28
  pour Top (no thermals): 103.12,65.53 103.12,61.72 106.17,61.72 106.17,65.53
+15V  (via drill 2.2 pad 0.33)
  Top 0.305: 116.35,53.86
  Top 4.445: 116.48,52.81 116.48,21.08 112.93,17.53 v107.31,17.53
  pour Top (no thermals): 99.82,55.88 99.82,53.09 102.36,53.09 103.63,52.32 109.22,52.32 109.22,50.29 112.27,50.29 112.27,52.32 118.62,52.32 118.62,56.13 117.86,56.9 113.79,56.9 112.78,55.88
-1.25V  (via drill 0.33, 0.8)
  Top 0.305: R27.1 v82.93,44.96 | R32.2 92.69,41.02 v94.23,41.02 | U12.6 84.18,34.44 84.2,34.42 | v89.79,44.7 88.8,44.7 U14.3 | U13.3 93.47,44.72 v93.47,45.47 | -1.25V.TP 26.92,26.04 v28.57,26.04
  Top 0.406: U10.11 76.58,43.18 C26.1 | U3.6 38.33,60.98 38.61,60.71 39.75,60.71 40.26,60.2 40.26,59.72 C14.1
  Top 0.61: C26.1 76.58,43.28 C28.1 78.74,43.43 | C17.- 28.32,23.24 26.67,21.59 U6.1 | v78.74,44.32 78.74,43.43 | 78.74,43.43 v80.01,43.43 | 95,41.27 95,43.31 95.38,43.69 U11.2 | 95.25,41.27 95,41.27 | v94.23,41.02 95,41.02 95.25,41.27 | 95,41.27 95,41.15 95.12,41.02 | 95.25,41.27 95.38,41.27 | 84.2,34.42 84.2,34.01 C29.1 83.69,33.3 v83.69,32.38 | v95.5,40.26 95.5,41.15 95.38,41.27 | C33.1 95.25,39.12 v95.38,38.99 | 95.38,41.27 C31.1
  Top 0.813: C17.- 28.32,25.78 v28.57,26.04 | C14.1 48.77,59.69 50.55,57.91 50.55,50.29 51.56,49.28 57.15,49.28 60.83,45.59 v60.83,33.53
  Route15 0.813: v28.57,26.04 57.02,26.04 57.66,26.67 57.66,32.13 59.05,33.53 v60.83,33.53
  Bottom 0.813: v60.83,33.53 64.52,33.53 67.06,36.07 67.06,38.86
  pour Bottom (isolate 0.254, no thermals): 66.8,45.72 97.41,45.72 97.41,38.35 85.85,38.35 85.85,32.38 83.06,32.38 83.06,38.35 66.8,38.35
-5V  (via drill 0.8)
  Top 0.305: -5V.TP 32.38,19.18 32.26,19.05 U6.6 | 30.48,19.05 U6.6 | U6.6
  Top 0.813: v32.89,14.48 30.99,14.48 30.86,14.61
  Top 1.27: L8.2 31.5,24
  Bottom 0.813: EXPANSION.5 47.12,12.19 46.1,13.21 34.16,13.21 v32.89,14.48
  pour Top (no thermals): 21.34,13.97 33.53,13.97 33.53,23.62 32,25.15 22.86,25.15 21.34,23.62
_VREF
  Top 0.305: U11.3 96.71,42.74 97.92,43.94 97.92,45.09 97.03,45.97 97.03,48.77 96.14,49.66 84.84,49.66 82.93,47.75 | 82.93,47.75 76.96,47.75 75.82,46.61 75.82,44.96 75.31,44.45 U10.12 72.14,44.45 71.12,45.47 71.12,47.75 69.99,48.88 | 69.98,48.88 69.99,48.88 | R24.2 69.99,50.94 69.99,48.88 | 82.93,47.75 R27.2
COM
  Top 0.305: U12.8 85.57,35.08 87.12,33.53 87.12,32 87.88,31.24 91.36,31.24 92.96,32.85 92.96,35.56 97.54,40.13 98.55,40.13 98.89,40.47 U11.4 100.88,42.74 C32.1
COMP+
  Top 0.254: U7.3 75.44,60.28 C18.1
  Top 0.305: R11.1 C18.1
CS
  Top 0.127: 33.73,56.13 34.54,56.13
  Top 0.178: 34.54,56.13 34.67,56.13 34.67,56.01 35.18,55.5 35.18,52.96 34.8,52.58 16.38,52.58 12.06,48.26 CS0.1 CS1.1 CS2.1 CS3.1
  Top 0.254: 33.73,56.13 U1.2
CS0
  Top 0.178: LEONARDO.D6 CS0.2
CS1
  Top 0.178: LEONARDO.D7 CS1.2
CS2
  Top 0.178: LEONARDO.D8 CS2.2
CS3
  Top 0.178: LEONARDO.D9 CS3.2
DACA  (via drill 0.33)
  Top 0.305: v38.12,68.83 18.36,68.83 VCTL<OFF>DAC.1 | U1.8 R4.2 41.17,57.68 v41.91,58.42
  Bottom 0.305: v38.12,68.83 38.12,68.82 39.75,67.18 41.78,67.18 43.18,65.79 43.18,59.69 v41.91,58.42
GND  (via drill 0.33, 0.33 pad 0.33, 0.6, 0.6 pad 0.61, 0.9, 1.3, 1.6 pad 0.33, 2)  (1 unrouted)
  Top 0.178: U12.5 83.53,35.65 83.82,35.94 84.58,35.94 84.84,35.69 U12.7 | U3.7 38.99,62.23 38.86,62.36 37.81,62.36 37.68,62.22 U3.5 | 37.68,65.7 v37.59,65.79
  Top 0.254: v76.83,59.18 U7.2 | R13.2 v70.87,64.64 | v76.58,63.63 76.56,63.6 C18.2 | C2.2 v47.5,57.28 | R21.2 v17.78,55.5
  Top 0.305: R20.1 69.06,29.69 v69.09,29.72 | Q1.E 80.2,60.77 v80.26,60.58 | 70.48,29.86 70.45,29.9 U9.4 | C24.2 v70.48,36.7 70.23,36.45 R17.2 | C23.2 77.21,24.9 77.22,24.89 | C20.2 78.99,29.96 78.99,29.97 | R26.2 v80.14,49.91 | C1.2 v62.87,51.82 | PWR.C v17.14,77.98 | R28.2 v95.5,48.77 | R35.1 92.43,37.19 v92.46,37.21 | U12.7 84.84,34.54 84.96,34.42 | R9.1 v95,64.26 | 37.47,65.66 v37.59,65.79 | D1.A v52.58,61.72 | Q3.E 23.07,64.05 v23.11,64.01
  Top 0.406: U8.2 76.45,25.78 77.21,25.02 C23.2 | R30.2 v80.14,40.64 | v36.7,56.01 U1.7 41.05,56.01 C4.2 | 31.5,56.39 29.21,56.39 29.23,56.36 C6.2 | v16.38,27.69 C7.2 | v20.57,27.69 C3.2 | U2.3 17.35,33.78 v17.14,33.78 | 84.96,34.42 85.09,34.29 85.09,34.16 | U3.5 37.68,60.52 C14.2 38.25,59.44 v37.59,59.44 | C36.2 37.72,65.66 v37.59,65.79
  Top 0.61: 29.21,56.26 v27.81,56.26 | v23.37,15.49 C16.+ 25.6,16.32 U6.4 | C17.+ v23.62,23.88 | C19.2 v69.72,60.07 | C21.2 77.39,24.74 C23.2 | C20.2 77.13,29.95 C22.2 | v79.25,23.62 79.25,24.64 v80.64,24.64 | v77.22,23.88 77.22,24.89 | v80.39,29.97 78.99,29.97 | v78.99,28.83 78.99,29.97 | 78.99,29.97 78.99,30.1 | v76.96,29.08 76.96,29.97 | 78.99,29.97 78.74,29.97 | C26.2 v76.71,45.97 | C28.2 v78.74,46.48 | v63.63,46.48 C27.2 | v65.66,45.97 65.66,44.96 | 65.66,44.96 C25.2 | v62.23,45.34 63.63,45.34 64.01,44.96 65.66,44.96 | v70.48,29.21 70.48,29.86 | C6.2 29.21,56.24 v29.21,55.12 | v30.99,55.12 31.36,55.49 C5.2 | C33.2 v89.79,39.12 | v96.65,40.26 96.65,40.79 C31.2 | v103.38,48.39 C34.2 | C30.2 v101.6,46.1 | v85.34,32.38 85.32,32.41 C29.2 85.32,33.93 85.09,34.16 | C35.2 81.92,39.14 v81.92,40.13
  Top 1.016: v50.04,43.94 L1.2
  Route2 1.016: v37.47,1.4 36.96,0.89 17.94,0.89
  other vias: 74.04,10.03 72.9,10.03 78.61,12.32 78.61,13.46 78.61,10.03 78.61,11.18 72.9,11.18 72.9,12.32 72.9,13.46 76.33,10.03 75.18,10.03 77.47,10.03 75.82,2.03 40.01,29.46 40.01,30.48 40.01,28.45 41.02,28.45 41.02,29.46 41.02,30.48 110.74,64.26 105.66,48.51 82.8,62.74 84.07,62.74 84.07,61.47 82.8,61.47 82.8,60.2 84.07,60.2 84.07,58.93 82.8,58.93 82.8,57.66 84.07,57.66 84.07,56.39 82.8,56.39 82.8,55.12 84.07,55.12 84.07,53.85 82.8,53.85 85.34,62.74 86.61,61.47 86.61,60.2 85.34,61.47 85.34,60.2 86.61,58.93 86.61,57.66 85.34,58.93 85.34,57.66 86.61,56.39 86.61,55.12 85.34,56.39 85.34,55.12 86.61,53.85 86.61,52.58 85.34,53.85 96.77,62.74 96.77,61.47 96.77,60.2 96.77,58.93 96.77,57.66 96.77,56.39 96.77,55.12 96.77,51.31 96.77,53.85 96.77,52.58 98.04,51.31 98.04,61.47 98.04,60.2 98.04,58.93 98.04,57.66 98.04,56.39 98.04,55.12 98.04,53.85 98.04,52.58 115.95,64.52 3.56,5.08 98.04,62.74 95.5,51.31 94.23,51.31 92.96,51.31 91.69,51.31 90.42,51.31 89.15,51.31 87.88,51.31 86.61,51.31 86.61,62.74 82.8,52.58 84.07,52.58 84.07,51.31 82.8,51.31 85.34,52.58 85.34,51.31
  pour Route2 (isolate 0.254, rank 3, no thermals): 0,65.28 0,78.66 1.23,79.88 27.05,80.01 124.97,80.14 124.97,0 47.62,0 47.62,9.27 44.07,9.27 44.07,4.7 36.58,4.7 33.53,1.65 20.83,1.65 20.83,24.61 22.76,26.54 57.15,26.54 57.15,46.99 56.64,47.5 52.83,47.5 52.83,43.43 49.53,43.43 39.62,53.09 39.62,58.8 37.34,58.8 37.34,68.07 24.89,68.07 24.89,65.23 22.91,63.25 8.64,63.25 8.64,65.28
  pour Route2 (isolate 0.254, no thermals): 56.64,27.05 56.64,46.86 56.52,46.99 53.34,46.99 53.34,42.93 49.28,42.93 39.12,52.83 39.12,58.29 36.83,58.29 36.83,67.56 25.4,67.56 25.4,64.89 23.24,62.74 8.13,62.74 8.13,64.77 0,64.77 0,0 20.32,0 20.32,24.97 22.4,27.05
  pour Bottom (isolate 0.381, rank 3, no thermals): 0,65.28 0,78.66 1.23,79.88 27.05,80.01 124.97,80.14 124.97,0 47.62,0 47.62,9.27 44.07,9.27 44.07,4.7 36.58,4.7 33.53,1.65 20.83,1.65 20.83,24.61 22.76,26.54 57.15,26.54 57.15,46.99 56.64,47.5 52.83,47.5 52.83,43.43 49.53,43.43 39.62,53.09 39.62,58.8 37.34,58.8 37.34,68.07 24.89,68.07 24.89,65.23 22.91,63.25 8.64,63.25 8.64,65.28
  pour Top (no thermals): 79.12,9.4 79.12,14.48 72.52,14.48 72.52,9.4
  pour Route2 (no thermals): 38.61,53.85 38.61,58.29 39.88,58.29 39.88,53.85
  pour Top (no thermals): 38.1,42.16 35.56,42.16 35.56,43.94 30.73,43.94 30.73,41.15 37.34,41.15 37.34,31.5 40.13,31.5 40.13,37.08 40.64,37.08 40.64,30.99 37.34,30.99 37.34,27.94 45.22,27.94 45.21,39.37 41.4,39.37 40.64,39.12 38.1,39.12
  pour Top (no thermals): 109.22,65.53 109.22,61.72 112.27,61.72 112.27,65.53
  pour Top (no thermals): 104.14,51.31 104.14,47.24 107.19,47.24 107.19,50.39 106.27,51.31
  pour Bottom: 98.81,63.5 98.81,50.8 82.3,50.8 82.3,63.5
  pour Top (no thermals): 98.81,63.5 98.81,50.8 82.3,50.8 82.3,63.5
IN  (via drill 0.33)
  Top 0.305: v82.68,32.26 84.71,30.23 90.68,30.23 91.95,28.96 91.95,19.56 100.58,10.92 v100.58,6.73 | v82.93,38.1 83.95,38.1 84.18,37.87 U12.3
  Bottom 0.305: v82.68,32.26 82.68,37.85 v82.93,38.1 | v100.58,6.73 AUX<FB>CURR.2
KEEPOUT
  cutout Route15 (isolate 0.381): 53.59,64.77 56.9,64.77 56.9,60.71 58.04,59.56 58.8,59.56 59.05,59.31 59.05,49.91 53.59,49.91
  cutout Bottom (isolate 0.381): 53.59,64.77 56.9,64.77 56.9,60.71 58.04,59.56 58.8,59.56 59.05,59.31 59.05,49.91 53.59,49.91
KEEPOUT_GND
  Top 1.016: LEONARDO.GND2 54.61,43.94 L1.1
  cutout Route2 (isolate 0.381, no thermals): 53.59,64.77 56.9,64.77 56.9,60.58 57.91,59.56 58.8,59.56 59.05,59.31 59.05,49.91 53.59,49.91
LDAC
  Top 0.178: U1.5 37.27,51.82 16.8,51.82 12.7,47.72 12.7,37.85 11.43,36.58 LEONARDO.D10
LED+  (via drill 1.1)
  Top 2.54: Q2.S 87.12,27.94
  Top 3.048: 87.12,27.94 85.34,26.16
  Top 3.81: LED+.1 LED+.2 85.34,26.16
  Bottom 1.422: 52.45,7.37 52.45,7.62 EXPANSION.2
  Bottom 2.54: LED+.1 81.53,6.35 v57.91,6.35 53.47,6.35 52.45,7.37
  pour Bottom (no thermals): 51.18,11.68 53.21,11.68 53.21,7.11 51.18,7.11
LED-  (via drill 1.1)
  Top 0.305: 85.28,36.45 85.47,36.64 85.47,37.29 U12.1 85.47,37.34 85.47,38.1
  Top 0.406: 85.28,36.45 82.87,36.45 | 82.87,36.45 82.68,36.26 | 82.74,36.26 82.87,36.39 82.87,36.45
  Top 0.61: U10.10 83.19,41.91 85.47,39.62 85.47,38.1
  Top 0.813: RSENSE.2 77.13,17.7 81.79,22.35 81.79,35.31 82.74,36.26 82.8,36.32
  Top 2.54: 66.38,17.7 LED-.2
  Top 3.81: LED-.1 LED-.2 | RSENSE.2 66.38,17.7
  Bottom 1.778: 49.66,6.6 EXPANSION.4
  Bottom 2.54: LED-.1 v57.91,2.54 53.09,2.54 49.66,5.97 49.66,6.6
  pour Bottom (no thermals): 48.64,11.68 50.67,11.68 50.67,7.11 48.64,7.11
N$1
  Top 0.254: R4.1 C2.1
N$2
  Top 0.305: R15.1 1AMP.A
N$3
  Top 0.254: PWR.A R10.1
N$4
  Top 0.305: R31.2 88.14,46.23 87.63,45.72 87.63,44.41 88.35,43.69 U14.2 | R31.2 90.93,46.23 | 91.03,46.23 R31.2 | R31.2 90.93,46.13 90.93,45.47 91.19,45.21 91.19,44.81 U13.4
N$5
  Top 0.254: R12.2 70.31,61.87 R13.1 | 73.48,60.12 U7.4
  Top 0.305: 71.25,61.87 R13.1 70.87,61.8 72.54,60.12 U7.4
N$6
  Top 0.305: R20.2 REF_ADJ.3
N$7
  Top 0.305: L6.1 LEONARDO.A0
N$8
  Top 0.305: U10.13 75.06,45.72 75.31,45.97 75.31,47.24 76.33,48.26 76.33,49.28 76.96,49.91 R26.1 79.1,51.64 R22.1
N$9  (via drill 0.33)
  Top 0.305: Q1.C v79.25,67.56 | v40.89,77.98 1AMP.C
  Bottom 0.305: v40.89,77.98 41.4,77.47 57.4,77.47 58.67,76.2 58.67,72.64 61.72,69.6 77.22,69.6 v79.25,67.56
N$10
  Top 0.305: U13.6 91.19,42.57 91.19,42.16 90.93,41.91 90.93,41.25 R32.1 88.14,41.15 87.63,41.66 87.63,42.97 86.91,43.69 U14.5
N$11
  Top 0.305: R3.2 65.66,54.99 C1.1 60.3,55.02 | L3.2 L4.2 60.3,55.02 | L6.2 L5.2 60.3,55.02
N$12
  Top 0.305: R8.1 99.06,64.26 | 99.06,64.26 R9.2 | U5.5 99.97,60.55 99.06,61.47 99.06,64.26
N$13  (via drill 0.25)
  Top 0.305: 95.5,44.64 U11.1 96.25,44.58 v97.16,44.58 | 95.5,44.64 94.93,44.64 93.98,43.69 U13.2 U13.5 | R28.1 95.5,44.64 | v98.93,43.69 100.1,43.69 C32.2
  Bottom 0.305: v97.16,44.58 98.04,43.69 v98.93,43.69
N$14
  Top 0.305: 50.16,72.73 TEST.2 50.16,72.47 50.16,70.48 47.24,67.56 R5.1
N$15
  Top 0.305: 77.23,40.77 R30.1 | U10.9 R30.1 | R29.1 77.36,40.46 R30.1
N$16
  Top 0.305: R16.1 OC.A
N$18
  Top 0.305: U9.2 71.37,31.32 71.63,31.57 71.63,31.62 71.65,31.65 R18.2 71.55,33.55 R17.1
N$19
  Top 0.305: LEONARDO.A1 L5.1
N$20
  Top 0.305: R19.2 73.37,24.51 U8.5
N$21
  Top 0.305: L4.1 LEONARDO.A2
N$22
  Top 0.305: R19.1 72.99,23.06 REF_ADJ.2
N$23
  Top 0.305: LEONARDO.A3 L3.1
N$24
  Top 0.305: R34.1 87.38,38.86 85.34,40.89 85.34,44.2 85.85,44.7 86.46,44.7 U14.4
N$25
  Top 0.305: R33.1 89.41,38.35 86.53,41.23 U14.6
N$26
  Top 0.305: R34.2 R33.2 | R33.2 R35.2 | Q2.G 89.65,35.22 R33.2
N$27
  Top 0.305: U7.1 78.29,58.24 R14.2
N$28
  Top 0.305: R14.1 78.37,61.83 Q1.B
N$32
  pour Top (no thermals): 36.83,40.64 36.83,37.08 30.73,37.08 30.73,40.64
N$33
  pour Top (no thermals): 36.83,36.58 36.83,31.5 30.73,31.5 30.73,36.58
N$34
  Top 0.305: VCTL<OFF>DAC.2 14.3,69.47 44.87,69.47 TEST.3
N$35
  Top 0.813: C12.1 R6.2 45.57,28.04 44.96,27.43 35.81,27.43 35.56,27.69 35.56,29.34 C15.1
  pour Top (no thermals): 36.83,30.99 30.23,30.99 30.23,36.58 26.42,36.58 26.42,26.92 36.83,26.92
N$36
  pour Top (no thermals): 38.35,39.62 40.64,39.62 41.4,39.88 44.7,39.88 44.7,42.93 43.18,42.93 40.64,41.15 38.35,41.15
N$37
  Top 0.305: GAIN.2 33.91,75.06 36.07,72.9 46.61,72.9 47.88,74.17 53.59,74.17 56.39,71.37 56.39,70.1 69.98,56.52 R24.1
N$38  (via drill 0.33)
  Top 0.254: OC.C 22.48,77.98 21.97,77.47 v21.97,70.87 | v21.97,68.07 21.97,67.82 21.08,66.93 Q3.C
  Bottom 0.254: v21.97,70.87 v21.97,68.07
N$39
  Top 0.178: R36.1 19.94,63.86
  Top 0.254: 19.94,63.86 Q3.B
N$40
  Top 0.178: LEONARDO.D2 OC0.2
NOPLANE
  cutout Bottom (no thermals): 95.5,45.09 95.5,42.29 99.57,42.29 99.57,45.09
  cutout Route2 (no thermals): 95.5,45.09 95.5,42.29 99.57,42.29 99.57,45.09
  cutout Route15 (no thermals): 95.5,45.09 95.5,42.29 99.57,42.29 99.57,45.09
OC0
  Top 0.178: LEONARDO.D3 OC1.2
OC1
  Top 0.178: LEONARDO.D4 OC2.2
OC2
  Top 0.178: LEONARDO.D5 OC3.2
OVER_CURR
  Top 0.178: 38.35,63.88 U3.3 38.35,63.83 38.35,63.12 38.1,62.87 36.83,62.87 36.58,63.12 36.58,65.02 34.16,67.44 26.8,67.44 25.91,66.55 25.91,64.77 23.37,62.23 17.88,62.23 | 17.78,58.42 17.8,58.42 R21.1 | R21.1 R36.2 | OC3.1 OC2.1 OC1.1 OC0.1 11.18,58.45 R21.1
  Top 0.254: R21.1 17.78,58.42 | 17.88,62.23 R36.2
POW_IN  (via drill 2.2 pad 0.33)
  Top 4.445: POWER.1 105.35,12 v99.82,17.53
REF2.5  (via drill 0.8 pad 0.3, 0.8 pad 0.33)
  Top 0.305: 70.83,26.44 REF_ADJ.1 | U9.3 70.4,30.61 71.63,30.61 71.88,30.35 71.88,26.7 72.14,26.44 | 73.28,26.44 U8.4 | REF2.5.TP v64.64,24.52 v64.64,24.51
  Top 0.406: C4.1 42.68,52.57 40.51,54.74 U1.6
  Top 0.61: U8.4 72.14,26.44 70.83,26.44 | REF_ADJ.1 70.35,25.77 69.09,24.51 v64.64,24.51
  Top 0.813: v57.78,35.69 57.78,46.99 56.77,48.01 50.42,48.01 46.74,51.69 C4.1
  Bottom 0.813: v57.78,35.69 57.78,29.84 63.12,24.51 v64.64,24.51
REF5.0  (via drill 0.33)
  Top 0.305: v65.41,38.35 70.36,38.35 71.12,37.59 72.52,37.59 73.38,36.73 C24.1 R18.1 | 65.4,38.35 v65.41,38.35 | TEST.1 52.71,72.39 v64.77,60.33 | U9.6 73.64,30.66 73.38,30.91 R18.1 | R18.1 73.18,33.66 | v65.41,38.35 65.4,38.35 REF5.0.TP
  Bottom 0.305: v64.77,60.33 64.77,38.99 v65.41,38.35
SCL/T3  (via drill 0.33, 1.3)
  Top 0.178: EXPANSION.8 44.58,3.43 v41.15,3.43 36.2,3.43 34.04,1.27 6.22,1.27 5.33,2.16 5.33,9.4 | 5.33,11.68 5.33,17.27 6.86,18.8 LEONARDO.SCL T3.1 | 5.33,11.68 5.33,9.4 | v5.59,9.4 5.33,9.4 | R1.2 5.33,11.68
  Bottom 0.178: v5.59,9.4 3.94,9.4 v3.56,8.76 | v41.15,1.4 v41.15,3.43
SCLK
  Top 0.178: U1.3 33.59,54.61 32.51,54.61 31.75,53.85 26.92,53.85 25.78,54.99 25.78,58.93 30.09,63.24 LEONARDO.SCK
SDA/T2  (via drill 1.3)
  Top 0.178: 4.83,12.45 4.83,19.56 6.6,21.34 LEONARDO.SDA T2.1 10.29,20.47 10.29,17.78 9.53,17.02 7.49,17.02 6.63,16.15 R2.2 | 4.83,12.45 4.83,1.91 5.97,0.76 34.29,0.76 36.32,2.79 44.58,2.79 | EXPANSION.6 47.12,4.06 45.85,2.79 44.58,2.79 | v3.56,12.45 4.83,12.45 | v44.58,1.4 44.58,2.79
SDI
  Top 0.178: U1.4 33.59,53.34 26.67,53.34 25.4,54.61 25.4,59.18 28.83,62.61 28.83,65.02 29.97,66.17 LEONARDO.MOSI
  Top 0.254: 33.77,53.59 U1.4 33.72,53.28
T0
  Top 0.178: LEONARDO.D11 T0.1
T1
  Top 0.178: LEONARDO.D12 T1.1
TRIG
  Top 0.178: 18.54,33.66 U2.2 18.54,34.67 18.03,35.18 12.29,35.18 T0.2 T1.2 T2.2 T3.2
TRIG_EXT
  Top 0.178: U2.5 18.54,26.92 12.83,21.21 TRIG.1
VAUX
  Top 0.305: 26.52,12.29 R25.1
  Top 0.406: U12.4 74.95,37.31 74.17,38.1 71.88,38.1 70.1,39.88 70.1,41.66 69.85,41.91 U10.5 67.31,41.91 66.29,40.89 63.75,40.89 62.74,39.88 62.74,20.45 56.77,14.48 46.1,14.48 EXPANSION.9 30.56,10.41 VAUX_IN.1 28.57,12.32 R25.1
VAUX_OUT  (via drill 0.33)
  Top 0.305: v66.42,40.01 67.06,39.37 U10.7 U10.6 | v66.42,62.48 66.42,63.37 72.64,69.6 81.97,69.6 VAUX_OUT.1
  Bottom 0.305: v66.42,62.48 v66.42,40.01
VCTL
  Top 0.305: D1.C 47.27,61.72 R5.2 44.48,61.75 VPRE.TP 44.3,61.87 R37.2 41.5,61.85 40.39,61.85 40.13,61.59 40.11,61.62 U3.8
VCTL_PROT
  Top 0.305: R23.2 40.54,68.58 41.78,68.58 42.67,67.69 42.67,64.77 41.53,63.63 R37.1 41.5,63.63 40.39,63.63 40.16,63.86 U3.1
VCTL_PROTECT
  Top 0.305: R23.1 34.19,70.33 31.37,73.15 GAIN.3
VI  (via drill 0.33)
  Top 0.305: 73.79,39.32 U10.8 | U10.8 72.64,39.37 v72.14,39.88 | v72.14,47.37 74.3,49.53 74.3,54.99 | U10.8 74.47,38.73 R29.2 | 74.3,54.99 74.3,60.58 74.04,60.83 72.55,60.83 72.01,61.37 72.01,63.12 72.39,63.5 73.05,63.5 R11.2 73.15,66.55 75.31,68.71 80.39,68.71 82.93,66.17 98.5,66.17 VI.1 | R3.1 74.3,54.99
  Route15 0.305: v72.14,39.88 v72.14,47.37
VIN_ARDUINO  (via drill 0.7)
  Top 1.016: LEONARDO.VIN L2.1 | v53.85,41.91 53.34,41.4 49.02,41.4 46.23,44.2 37.83,44.2 U4.5
  Bottom 1.016: v53.85,41.91 53.85,44.08 LEONARDO.VIN
  pour Top (no thermals): 30.23,37.08 26.42,37.08 26.42,48.01 38.86,48.01 38.86,42.42 36.07,42.42 36.07,44.45 30.23,44.45
VINPUT  (via drill 0.33)
  Top 0.305: v32,79.12 29.84,76.96 29.84,72.52 27.43,70.1 10.24,70.1 VCTL<OFF>DAC.3 | v59.94,79.12 64.77,79.12 68.33,75.56 VCTL.1
  Bottom 0.305: v32,79.12 v59.94,79.12
VLOGIC  (via drill 0.6 pad 0.33)
  Top 0.178: U2.4 17.88,31.85 18.16,32.13 19.05,32.13 19.2,32.28 U2.1
  Top 0.406: 16.38,30.48 17.4,30.48 17.91,30.99 U2.4
  Top 0.813: v16.38,32 16.38,30.48 C7.1
  Bottom 0.813: LEONARDO.IOREF 48.01,30.48 44.96,27.43 28.7,27.43 23.37,32.77 17.14,32.77 v16.38,32
VREF
  Top 0.305: U10.14 73.91,47.06 73.91,48.01 75.31,49.4 75.31,51.82 | R22.2 75.31,51.82 | 75.31,51.82 75.31,55.02 77.32,57.02 80.14,57.02 81.41,58.29 81.41,63.75 83.19,65.53 100.97,65.53 102.92,67.49 VREF.1

### Text on the board
tPlace: (DNP) | GND | (DNP) | (DNP) | Cyclops Rev. 3.5D / CC BY-SA-NC 4.0 / Jon Newman / 2015 | S0 | S1 | (DNP) | SDA | PANEL SWITCH. / SHORT IF NOT / IN USE. | SCL | LED+ | DGND | LED- | GND | +12V | DGND | SCL | SDA
bPlace: DAC<OFF>VCTL | GND | SDA | Cyclops / Rev. 3.5C | SCL | CC BY-SA-NC 4.0 / Jon Newman / 2015 | DGND | LED+ | GND | +12V | DGND | SCL | SDA | LED-
tDocu: DISABLE | DAC | VCTL